# Altium project BTB.PrjPcb (part 1 of 2)
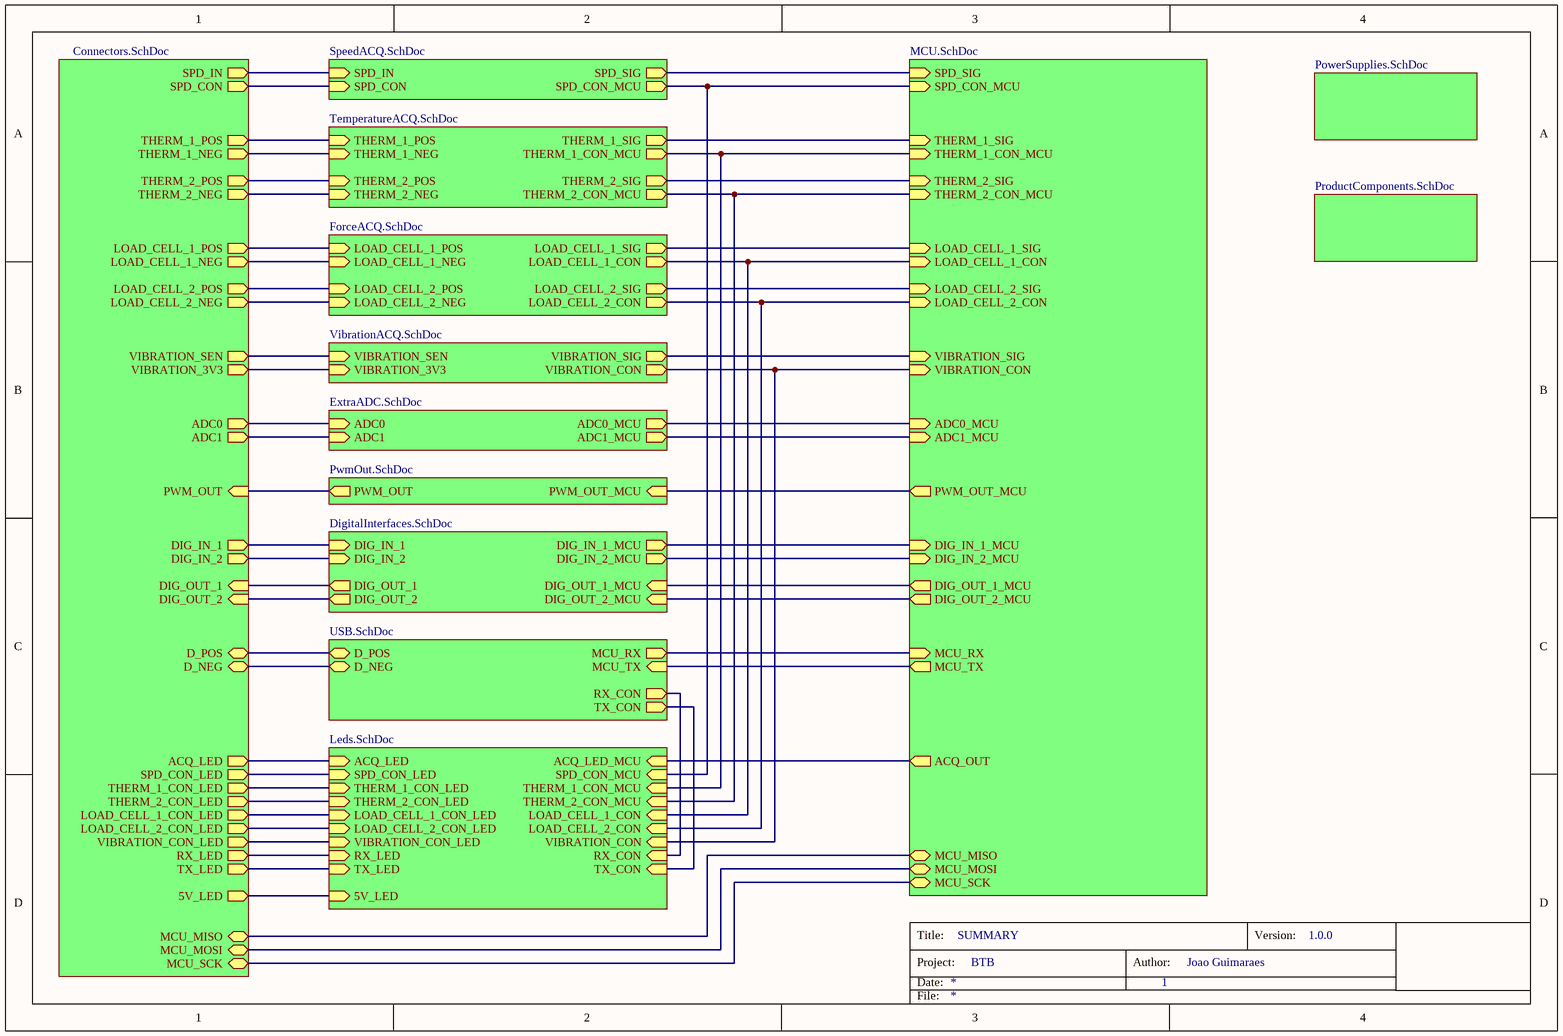
[diagram p0: SUMMARY.SchDoc]
ProjectName: BTB; ProjectVersion: 1.0.0
14 sheets, 231 parts. Net scope: hierarchical (ports join the sheet entries above them; power ports are global).
Board file: PCB.PcbDoc
Sheets:
  SUMMARY.SchDoc
    TemperatureACQ = TemperatureACQ.SchDoc
    ForceACQ = ForceACQ.SchDoc
    VibrationACQ = VibrationACQ.SchDoc
    SpeedACQ = SpeedACQ.SchDoc
    PowerSupplies = PowerSupplies.SchDoc
    MCU = MCU.SchDoc
    PwmOut = PwmOut.SchDoc
    DigitalIntefaces = DigitalInterfaces.SchDoc
    Connectors = Connectors.SchDoc
    Leds = Leds.SchDoc
    USB = USB.SchDoc
    Designator = ExtraADC.SchDoc
    ProductComponents = ProductComponents.SchDoc

## Sheet SUMMARY.SchDoc: SUMMARY
size A4; Author: Joao Guimaraes; Organization: Altium Limited; Address1: L3, 12a Rodborough Rd; Address2: Frenchs Forest; Address3: NSW; Address4: Australia 2086; Revision: 1.0.0; SheetNumber: 1

### Sub-sheets
Connectors = Connectors.SchDoc: SPD_IN (out), SPD_CON (out), THERM_1_POS (out), THERM_1_NEG (out), THERM_2_POS (out), THERM_2_NEG (out), LOAD_CELL_1_POS (out), LOAD_CELL_1_NEG (out), LOAD_CELL_2_POS (out), LOAD_CELL_2_NEG (out), VIBRATION_SEN (out), VIBRATION_3V3 (out), DIG_IN_1 (out), DIG_IN_2 (out), DIG_OUT_1 (in), DIG_OUT_2 (in), D_POS, D_NEG, MCU_MISO, MCU_MOSI, MCU_SCK, ACQ_LED (out), RX_LED (out), SPD_CON_LED (out), THERM_1_CON_LED (out), THERM_2_CON_LED (out), LOAD_CELL_1_CON_LED (out), LOAD_CELL_2_CON_LED (out), VIBRATION_CON_LED (out), TX_LED (out), ADC1 (out), PWM_OUT (in), ADC0 (out), 5V_LED (out)
Designator = ExtraADC.SchDoc: ADC0 (in), ADC1 (in), ADC0_MCU (out), ADC1_MCU (out)
DigitalIntefaces = DigitalInterfaces.SchDoc: DIG_IN_1 (in), DIG_IN_2 (in), DIG_OUT_1 (out), DIG_OUT_2 (out), DIG_IN_1_MCU (out), DIG_IN_2_MCU (out), DIG_OUT_1_MCU (in), DIG_OUT_2_MCU (in)
ForceACQ = ForceACQ.SchDoc: LOAD_CELL_1_POS (in), LOAD_CELL_1_NEG (in), LOAD_CELL_2_POS (in), LOAD_CELL_2_NEG (in), LOAD_CELL_1_CON (out), LOAD_CELL_1_SIG (out), LOAD_CELL_2_SIG (out), LOAD_CELL_2_CON (out)
Leds = Leds.SchDoc: ACQ_LED_MCU (in), SPD_CON_MCU (in), THERM_1_CON_MCU (in), THERM_2_CON_MCU (in), LOAD_CELL_1_CON (in), LOAD_CELL_2_CON (in), VIBRATION_CON (in), ACQ_LED (in), SPD_CON_LED (in), THERM_1_CON_LED (in), THERM_2_CON_LED (in), LOAD_CELL_1_CON_LED (in), LOAD_CELL_2_CON_LED (in), VIBRATION_CON_LED (in), RX_CON (in), TX_CON (in), RX_LED (in), TX_LED (in), 5V_LED (in)
MCU = MCU.SchDoc: SPD_SIG (in), SPD_CON_MCU (in), THERM_1_SIG (in), THERM_1_CON_MCU (in), THERM_2_SIG (in), THERM_2_CON_MCU (in), LOAD_CELL_1_SIG (in), LOAD_CELL_1_CON (in), LOAD_CELL_2_SIG (in), LOAD_CELL_2_CON (in), VIBRATION_SIG (in), VIBRATION_CON (in), PWM_OUT_MCU (out), DIG_IN_1_MCU (in), DIG_IN_2_MCU (in), DIG_OUT_1_MCU (out), DIG_OUT_2_MCU (out), MCU_RX (in), MCU_TX (out), MCU_MISO, MCU_MOSI, MCU_SCK, ACQ_OUT (out), ADC0_MCU (in), ADC1_MCU (in)
PowerSupplies = PowerSupplies.SchDoc: no entries
ProductComponents = ProductComponents.SchDoc: no entries
PwmOut = PwmOut.SchDoc: PWM_OUT_MCU (in), PWM_OUT (out)
SpeedACQ = SpeedACQ.SchDoc: SPD_IN (in), SPD_SIG (out), SPD_CON_MCU (out), SPD_CON (in)
TemperatureACQ = TemperatureACQ.SchDoc: THERM_1_NEG (in), THERM_2_POS (in), THERM_2_NEG (in), THERM_1_POS (in), THERM_1_SIG (out), THERM_1_CON_MCU (out), THERM_2_SIG (out), THERM_2_CON_MCU (out)
USB = USB.SchDoc: D_POS, D_NEG, MCU_RX (out), MCU_TX (in), RX_CON (out), TX_CON (out)
VibrationACQ = VibrationACQ.SchDoc: VIBRATION_SEN (in), VIBRATION_3V3 (in), VIBRATION_SIG (out), VIBRATION_CON (out)

### Nets
NetC6_2: sheet VibrationACQ/VIBRATION_SEN, sheet Connectors/VIBRATION_SEN
NetC36_1: sheet PwmOut/PWM_OUT, sheet Connectors/PWM_OUT
NetC38_2: sheet SpeedACQ/SPD_SIG, sheet MCU/SPD_SIG
NetP1_5: sheet ForceACQ/LOAD_CELL_1_NEG, sheet Connectors/LOAD_CELL_1_NEG
NetP1_6: sheet ForceACQ/LOAD_CELL_1_POS, sheet Connectors/LOAD_CELL_1_POS
NetP1_10: sheet ForceACQ/LOAD_CELL_2_NEG, sheet Connectors/LOAD_CELL_2_NEG
NetP1_11: sheet ForceACQ/LOAD_CELL_2_POS, sheet Connectors/LOAD_CELL_2_POS
NetP2_1: sheet Connectors/5V_LED, sheet Leds/5V_LED
NetP2_2: sheet Connectors/TX_LED, sheet Leds/TX_LED
NetP2_3: sheet Connectors/RX_LED, sheet Leds/RX_LED
NetP2_4: sheet Connectors/ACQ_LED, sheet Leds/ACQ_LED
NetP2_5: sheet Connectors/SPD_CON_LED, sheet Leds/SPD_CON_LED
NetP2_6: sheet Connectors/THERM_1_CON_LED, sheet Leds/THERM_1_CON_LED
NetP2_7: sheet Connectors/THERM_2_CON_LED, sheet Leds/THERM_2_CON_LED
NetP2_8: sheet Connectors/LOAD_CELL_1_CON_LED, sheet Leds/LOAD_CELL_1_CON_LED
NetP2_9: sheet Connectors/LOAD_CELL_2_CON_LED, sheet Leds/LOAD_CELL_2_CON_LED
NetP2_10: sheet Connectors/VIBRATION_CON_LED, sheet Leds/VIBRATION_CON_LED
NetP2_12: sheet Connectors/ADC0, sheet Designator/ADC0
NetP2_14: sheet Connectors/ADC1, sheet Designator/ADC1
NetP3_2: sheet Connectors/D_POS, sheet USB/D_POS
NetP3_3: sheet Connectors/D_NEG, sheet USB/D_NEG
NetP3_7: sheet VibrationACQ/VIBRATION_3V3, sheet Connectors/VIBRATION_3V3
NetP3_12: sheet SpeedACQ/SPD_IN, sheet Connectors/SPD_IN
NetP3_13: sheet SpeedACQ/SPD_CON, sheet Connectors/SPD_CON
NetP4_1: sheet TemperatureACQ/THERM_1_POS, sheet Connectors/THERM_1_POS
NetP4_2: sheet TemperatureACQ/THERM_1_NEG, sheet Connectors/THERM_1_NEG
NetP4_3: sheet TemperatureACQ/THERM_2_POS, sheet Connectors/THERM_2_POS
NetP4_4: sheet TemperatureACQ/THERM_2_NEG, sheet Connectors/THERM_2_NEG
NetP4_5: sheet DigitalIntefaces/DIG_OUT_1, sheet Connectors/DIG_OUT_1
NetP4_7: sheet DigitalIntefaces/DIG_OUT_2, sheet Connectors/DIG_OUT_2
NetP4_9: sheet DigitalIntefaces/DIG_IN_1, sheet Connectors/DIG_IN_1
NetP4_11: sheet DigitalIntefaces/DIG_IN_2, sheet Connectors/DIG_IN_2
NetP5_1: sheet MCU/DIG_IN_2_MCU, sheet MCU/MCU_MISO, sheet DigitalIntefaces/DIG_IN_2_MCU, sheet Connectors/MCU_MISO
NetP5_3: sheet MCU/MCU_SCK, sheet MCU/ACQ_OUT, sheet Connectors/MCU_SCK, sheet Leds/ACQ_LED_MCU
NetP5_4: sheet MCU/DIG_IN_1_MCU, sheet MCU/MCU_MOSI, sheet DigitalIntefaces/DIG_IN_1_MCU, sheet Connectors/MCU_MOSI
NetQ5_2: sheet Leds/TX_CON, sheet USB/TX_CON
NetQ5_5: sheet Leds/RX_CON, sheet USB/RX_CON
NetQ6_3: sheet SpeedACQ/SPD_CON_MCU, sheet MCU/SPD_CON_MCU, sheet Leds/SPD_CON_MCU
NetQ7_3: sheet VibrationACQ/VIBRATION_CON, sheet MCU/VIBRATION_CON, sheet Leds/VIBRATION_CON
NetR7_1: sheet MCU/DIG_OUT_1_MCU, sheet DigitalIntefaces/DIG_OUT_1_MCU
NetR13_1: sheet MCU/DIG_OUT_2_MCU, sheet DigitalIntefaces/DIG_OUT_2_MCU
NetR15_2: sheet MCU/ADC0_MCU, sheet Designator/ADC0_MCU
NetR17_1: sheet MCU/ADC1_MCU, sheet Designator/ADC1_MCU
NetR19_2: sheet ForceACQ/LOAD_CELL_1_CON, sheet MCU/LOAD_CELL_1_CON, sheet Leds/LOAD_CELL_1_CON
NetR20_2: sheet ForceACQ/LOAD_CELL_1_SIG, sheet MCU/LOAD_CELL_1_SIG
NetR27_2: sheet ForceACQ/LOAD_CELL_2_CON, sheet MCU/LOAD_CELL_2_CON, sheet Leds/LOAD_CELL_2_CON
NetR28_2: sheet ForceACQ/LOAD_CELL_2_SIG, sheet MCU/LOAD_CELL_2_SIG
NetR45_2: sheet TemperatureACQ/THERM_2_CON_MCU, sheet MCU/THERM_2_CON_MCU, sheet Leds/THERM_2_CON_MCU
NetR46_2: sheet TemperatureACQ/THERM_1_CON_MCU, sheet MCU/THERM_1_CON_MCU, sheet Leds/THERM_1_CON_MCU
NetR64_1: sheet MCU/PWM_OUT_MCU, sheet PwmOut/PWM_OUT_MCU
NetR79_1: sheet TemperatureACQ/THERM_1_SIG, sheet MCU/THERM_1_SIG
NetR88_1: sheet TemperatureACQ/THERM_2_SIG, sheet MCU/THERM_2_SIG
NetR96_2: sheet MCU/MCU_TX, sheet USB/MCU_TX
NetR97_2: sheet MCU/MCU_RX, sheet USB/MCU_RX
NetR99_1: sheet VibrationACQ/VIBRATION_SIG, sheet MCU/VIBRATION_SIG

### Notes on the sheet
- Title:
- Project:
- Date:
- Author:
- Version:
- File:

## Sheet TemperatureACQ.SchDoc: TemperatureACQ
size A4; Author: Joao Guimaraes; Organization: Altium Limited; Address1: L3, 12a Rodborough Rd; Address2: Frenchs Forest; Address3: NSW; Address4: Australia 2086; Revision: 1.0
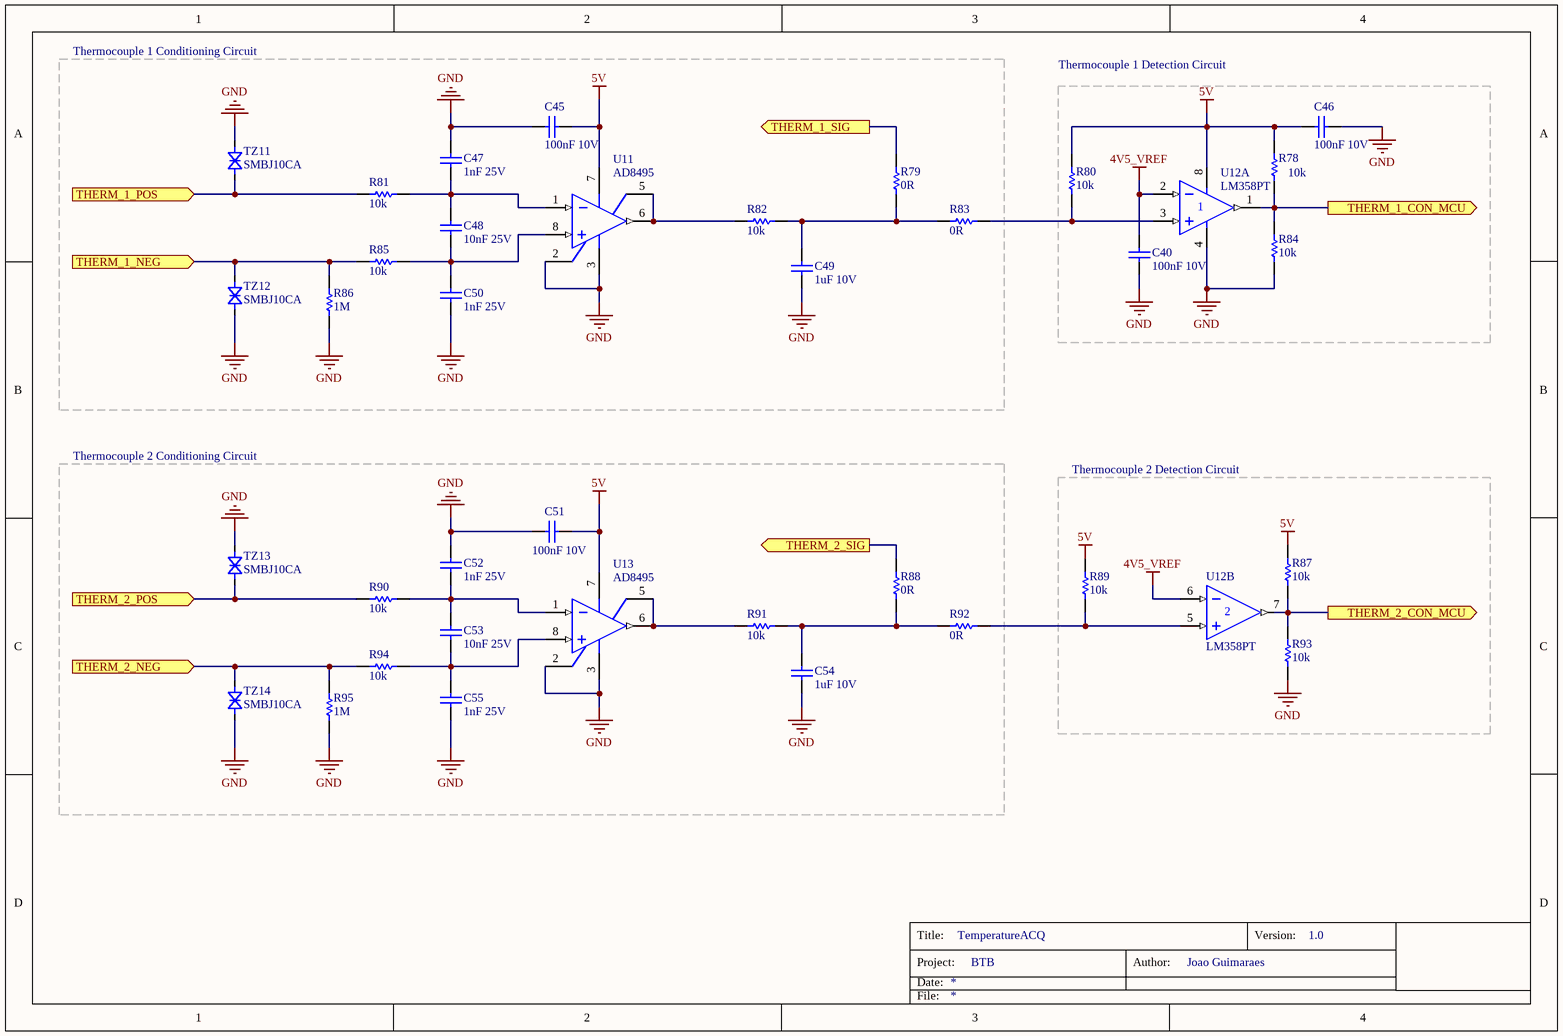
[diagram p1: TemperatureACQ.SchDoc]

### Parts
C40  100nF 10V  [0402]
C45  100nF 10V  [0402]
C46  100nF 10V  [0402]
C47  1nF 25V  [1608[0603]]
C48  10nF 25V  [1608[0603]]
C49  1uF 10V  [C0805]
C50  1nF 25V  [1608[0603]]
C51  100nF 10V  [0402]
C52  1nF 25V  [1608[0603]]
C53  10nF 25V  [1608[0603]]
C54  1uF 10V  [C0805]
C55  1nF 25V  [1608[0603]]
R78  10k  [6-0805_M]
R79  0R  [6-0805_M]
R80  10k  [6-0805_M]
R81  10k  [6-0805_M]
R82  10k  [6-0805_M]
R83  0R  [6-0805_M]
R84  10k  [6-0805_M]
R85  10k  [6-0805_M]
R86  1M  [6-0805_M]
R87  10k  [6-0805_M]
R88  0R  [6-0805_M]
R89  10k  [6-0805_M]
R90  10k  [6-0805_M]
R91  10k  [6-0805_M]
R92  0R  [6-0805_M]
R93  10k  [6-0805_M]
R94  10k  [6-0805_M]
R95  1M  [6-0805_M]
TZ11  SMBJ10CA  [DO-214AA]
TZ12  SMBJ10CA  [DO-214AA]
TZ13  SMBJ10CA  [DO-214AA]
TZ14  SMBJ10CA  [DO-214AA]
U11  AD8495  [RM_8]
U12  LM358PT  [TSOP-8]  (parts A,B of 2)
U13  AD8495  [RM_8]

### Blocks framed on the sheet
Thermocouple 1 Conditioning Circuit: C45 C47-C50 R79 R81-R83 R85 R86 TZ11 TZ12 U11
Thermocouple 1 Detection Circuit: C40 C46 R78 R80 R84 U12
Thermocouple 2 Conditioning Circuit: C51-C55 R88 R90-R92 R94 R95 TZ13 TZ14 U13
Thermocouple 2 Detection Circuit: R87 R89 R93 U12

### Ports
THERM_1_CON_MCU (out), THERM_1_NEG (in), THERM_1_POS (in), THERM_1_SIG (out), THERM_2_CON_MCU (out), THERM_2_NEG (in), THERM_2_POS (in), THERM_2_SIG (out)

### Nets
4V5_VREF: C40.2 U12.2(IN-) U12.6(IN-)
5V: C45.2 C46.2 C51.2 R78.1 R80.1 R87.1 R89.1 U11.7(V+) U12.8(Vs+) U13.7(V+)
GND: C40.1 C45.1 C46.1 C47.2 C49.1 C50.1 C51.1 C52.2 C54.1 C55.1 R84.2 R86.1 R93.2 R95.1 TZ11.2(A) TZ12.1(C) TZ13.2(A) TZ14.1(C) U11.2(REF) U11.3(V-) U12.4(Vs-) U13.2(REF) U13.3(V-)
NetC47_1: C47.1 C48.2 R81.2 U11.1(IN-)
NetC48_1: C48.1 C50.2 R85.2 U11.8(IN+)
NetC49_2: C49.2 R79.2 R82.1 R83.1
NetC52_1: C52.1 C53.2 R90.2 U13.1(IN-)
NetC53_1: C53.1 C55.2 R94.2 U13.8(IN+)
NetC54_2: C54.2 R88.2 R91.1 R92.1
NetP4_1: R81.1 TZ11.1(C) ; port THERM_1_POS
NetP4_2: R85.1 R86.2 TZ12.2(A) ; port THERM_1_NEG
NetP4_3: R90.1 TZ13.1(C) ; port THERM_2_POS
NetP4_4: R94.1 R95.2 TZ14.2(A) ; port THERM_2_NEG
NetR45_2: R87.2 R93.1 U12.7(OUT) ; port THERM_2_CON_MCU
NetR46_2: R78.2 R84.1 U12.1(OUT) ; port THERM_1_CON_MCU
NetR79_1: R79.1 ; port THERM_1_SIG
NetR80_2: R80.2 R83.2 U12.3(IN+)
NetR82_2: R82.2 U11.5(SENSE) U11.6(OUT)
NetR88_1: R88.1 ; port THERM_2_SIG
NetR89_2: R89.2 R92.2 U12.5(IN+)
NetR91_2: R91.2 U13.5(SENSE) U13.6(OUT)

### Notes on the sheet
- Title:
- Project:
- Date:
- Author:
- Version:
- File:

### Library data of the parts
C40 C45 C46 C51 = Cap: Capacitor; PartNumber: CAP.100n.10V.20%.SMD.0402; Manufacturer: Wurth; ClassName: TemperatureACQ; Price: 0.015; Supplier: Mouser
C47 C55 = Cap: Capacitor; PartNumber: CAP.1n.25V.10%.SMD.0603; Manufacturer: Wurth; ClassName: TemperatureACQ; Price: 0.10; Supplier: Mouser
C48 C53 = Cap: Capacitor; PartNumber: CAP.10n.25V.10%.SMD.0603; Manufacturer: Wurth; ClassName: TemperatureACQ; Price: 0.10; Supplier: Mouser
C49 C54 = Cap: Capacitor; PartNumber: CAP.1u.10V.10%.SMD.0805; Manufacturer: Vishay; ClassName: TemperatureACQ; Price: 0.17; Supplier: Mouser
C50 C52 = Cap: Capacitor; PartNumber: CAP.1n.25V.10%.SMD.0603; Manufacturer: Vishay; ClassName: TemperatureACQ; Price: 0.10; Supplier: Mouser
R78 R81 R82 R84 R85 R87 R90 R91 R93 R94 = Res: Resistor; PartNumber: RES.10K.1/8W.5%.SMD.0805; Manufacturer: Yageo; ClassName: TemperatureACQ; Price: 0.012; Supplier: Mouser
R79 R83 R88 R92 = Res: Resistor; PartNumber: RES.0R.1/8W.5%.SMD.0805; Manufacturer: Vishay; ClassName: TemperatureACQ; Price: 0.044; Supplier: Mouser
R80 R89 = Res: Resistor; PartNumber: RES.10k.1/8W.5%.SMD.0805; Manufacturer: Bourns; ClassName: TemperatureACQ; Price: 0.012; Supplier: Mouser
R86 R95 = Res: Resistor; PartNumber: RES.1M.1/8W.5%.SMD.0805; Manufacturer: Bourns; ClassName: TemperatureACQ; Price: 0.012; Supplier: Mouser
TZ11-TZ14 = SMBJ10CA: ESD Suppressors / TVS Diodes 600W 10.0V; pin to pad: 1>C 2>A; PartNumber: SMBJ10CA-13-F; ClassName: TemperatureACQ; Price: 0.35; Supplier: Mouser; Manufacturer: Diodes
U11 U13 = AD8495: Precision Type K Thermocouple Amplifier with Cold Junction Compensation; PartNumber: AD8495CRMZ-R7; Manufacturer: Analog Devices; ClassName: TemperatureACQ; Price: 10.84; Supplier: Mouser
U12 = LM358PT: Operational Amplifiers - Op Amps Dual Low Power; Manufacturer: STMicroelectronics; ClassName: TemperatureACQ; PartNumber: LM358PT; Price: 0.40; Supplier: Mouser

## Sheet ForceACQ.SchDoc: Force Acquisition Channel
size A4; Author: Joao Guimarae; Organization: Altium Limited; Address1: L3, 12a Rodborough Rd; Address2: Frenchs Forest; Address3: NSW; Address4: Australia 2086; Revision: 1.0.0
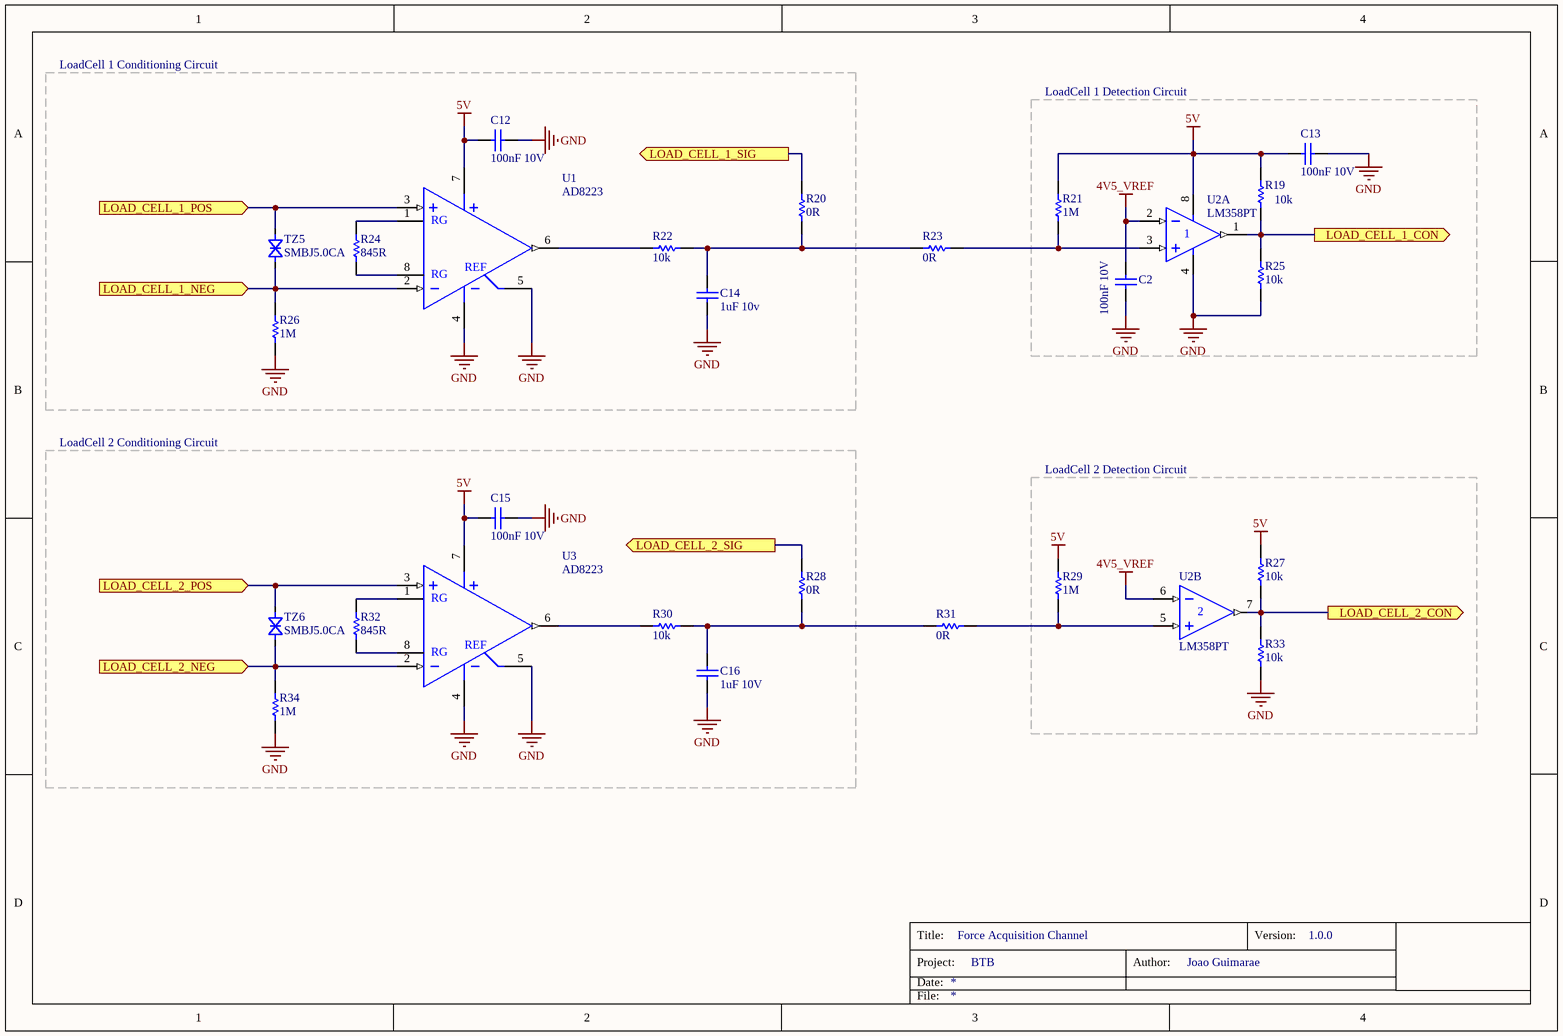
[diagram p2: ForceACQ.SchDoc]

### Parts
C2  100nF 10V  [0402]
C12  100nF 10V  [0402]
C13  100nF 10V  [0402]
C14  1uF 10v  [C0805]
C15  100nF 10V  [0402]
C16  1uF 10V  [C0805]
R19  10k  [6-0805_M]
R20  0R  [6-0805_M]
R21  1M  [6-0805_M]
R22  10k  [6-0805_M]
R23  0R  [6-0805_M]
R24  845R  [0402]
R25  10k  [6-0805_M]
R26  1M  [6-0805_M]
R27  10k  [6-0805_M]
R28  0R  [6-0805_M]
R29  1M  [6-0805_M]
R30  10k  [6-0805_M]
R31  0R  [6-0805_M]
R32  845R  [0402]
R33  10k  [6-0805_M]
R34  1M  [6-0805_M]
TZ5  SMBJ5.0CA  [DO-214AA]
TZ6  SMBJ5.0CA  [DO-214AA]
U1  AD8223  [SO8_M]
U2  LM358PT  [TSOP-8]  (parts A,B of 2)
U3  AD8223  [SO8_M]

### Blocks framed on the sheet
LoadCell 1 Conditioning Circuit: C12 C14 R20 R22 R24 R26 TZ5 U1
LoadCell 1 Detection Circuit: C2 C13 R19 R21 R25 U2
LoadCell 2 Conditioning Circuit: C15 C16 R28 R30 R32 R34 TZ6 U3
LoadCell 2 Detection Circuit: R27 R29 R33 U2

### Ports
LOAD_CELL_1_CON (out), LOAD_CELL_1_NEG (in), LOAD_CELL_1_POS (in), LOAD_CELL_1_SIG (out), LOAD_CELL_2_CON (out), LOAD_CELL_2_NEG (in), LOAD_CELL_2_POS (in), LOAD_CELL_2_SIG (out)

### Nets
4V5_VREF: C2.2 U2.2(IN-) U2.6(IN-)
5V: C12.1 C13.2 C15.1 R19.1 R21.1 R27.1 R29.1 U1.7(+Vs) U2.8(Vs+) U3.7(+Vs)
GND: C2.1 C12.2 C13.1 C14.1 C15.2 C16.1 R25.2 R26.2 R33.2 R34.2 U1.4(-Vs) U1.5(REF) U2.4(Vs-) U3.4(-Vs) U3.5(REF)
NetC14_2: C14.2 R20.1 R22.2 R23.2
NetC16_2: C16.2 R28.1 R30.2 R31.2
NetP1_5: R26.1 TZ5.1(C) U1.2(IN-) ; port LOAD_CELL_1_NEG
NetP1_6: TZ5.2(A) U1.3(IN+) ; port LOAD_CELL_1_POS
NetP1_10: R34.1 TZ6.1(C) U3.2(IN-) ; port LOAD_CELL_2_NEG
NetP1_11: TZ6.2(A) U3.3(IN+) ; port LOAD_CELL_2_POS
NetR19_2: R19.2 R25.1 U2.1(OUT) ; port LOAD_CELL_1_CON
NetR20_2: R20.2 ; port LOAD_CELL_1_SIG
NetR21_2: R21.2 R23.1 U2.3(IN+)
NetR22_1: R22.1 U1.6(OUT)
NetR24_1: R24.1 U1.8(RG)
NetR24_2: R24.2 U1.1(RG)
NetR27_2: R27.2 R33.1 U2.7(OUT) ; port LOAD_CELL_2_CON
NetR28_2: R28.2 ; port LOAD_CELL_2_SIG
NetR29_2: R29.2 R31.1 U2.5(IN+)
NetR30_1: R30.1 U3.6(OUT)
NetR32_1: R32.1 U3.8(RG)
NetR32_2: R32.2 U3.1(RG)

### Notes on the sheet
- Title:
- Project:
- Date:
- Author:
- Version:
- File:

### Library data of the parts
C2 C12 C13 C15 = Cap: as C40 on sheet TemperatureACQ; Price: 0.015; Supplier: Mouser
  C2: ClassName: TemperatureACQ
  C12 C13 C15: ClassName: ForceACQ
C14 C16 = Cap: as C49 on sheet TemperatureACQ; ClassName: ForceACQ; Price: 0.17; Supplier: Mouser
R19 R22 R25 R27 R30 R33 = Res: as R78 on sheet TemperatureACQ; ClassName: ForceACQ; Price: 0.012; Supplier: Mouser
R20 R23 R28 R31 = Res: as R79 on sheet TemperatureACQ; ClassName: ForceACQ; Price: 0.044; Supplier: Mouser
R21 R26 R29 R34 = Res: as R86 on sheet TemperatureACQ; ClassName: ForceACQ; Supplier: Mouser
  R21 R29 R34: Price: 0.012
  R26: Price: 0.10
R24 R32 = Res: Resistor; PartNumber: RES.845R.1/8W.1%.SMD.0402; Manufacturer: Yageo; ClassName: ForceACQ; Price: 0.10; Supplier: Mouser
TZ5 TZ6 = SMBJ5.0CA: ESD Suppressors / TVS Diodes 5Vr 600W 65.3A 5% BiDirectional; pin to pad: 1>C 2>A; Manufacturer: Bourns; ClassName: ForceACQ; PartNumber: SMBJ5.0CA; Price: 0.44; Supplier: Mouser
U1 U3 = AD8223: Precision Instrumentation Amplifier; PartNumber: AD8223ARZ; Manufacturer: Analog Devices; ClassName: ForceACQ; Price: 2.89; Supplier: Mouser
U2 = LM358PT: as U12 on sheet TemperatureACQ; ClassName: ForceACQ; PartNumber: LM358PT; Price: 0.40; Supplier: Mouser

## Sheet VibrationACQ.SchDoc: VibrationACQ
size A4; Author: Joao Guimaraes; Organization: Altium Limited; Address1: L3, 12a Rodborough Rd; Address2: Frenchs Forest; Address3: NSW; Address4: Australia 2086; Revision: 1.0.0
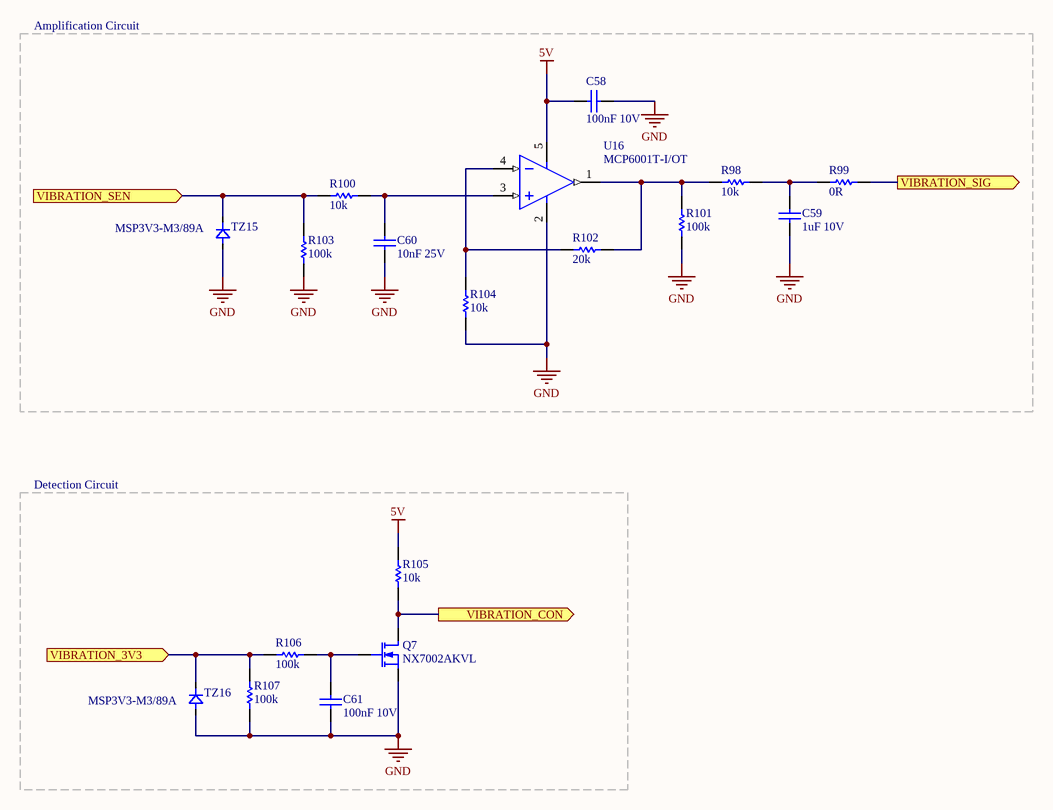
[diagram p3: VibrationACQ.SchDoc]

### Parts
C58  100nF 10V  [0402]
C59  1uF 10V  [C0805]
C60  10nF 25V  [1608[0603]]
C61  100nF 10V  [0402]
Q7  NX7002AKVL  [SOT23_M]
R98  10k  [6-0805_M]
R99  0R  [6-0805_M]
R100  10k  [6-0805_M]
R101  100k  [6-0805_M]
R102  20k  [6-0805_M]
R103  100k  [6-0805_M]
R104  10k  [6-0805_M]
R105  10k  [6-0805_M]
R106  100k  [6-0805_M]
R107  100k  [6-0805_M]
TZ15  MSP3V3-M3/89A  [DO-219AD]
TZ16  MSP3V3-M3/89A  [DO-219AD]
U16  MCP6001T-I/OT  [SOT23-5]

### Blocks framed on the sheet
Amplification Circuit: C58-C60 R98-R104 TZ15 U16
Detection Circuit: C61 Q7 R105-R107 TZ16

### Ports
VIBRATION_3V3 (in), VIBRATION_CON (out), VIBRATION_SEN (in), VIBRATION_SIG (out)

### Nets
5V: C58.1 R105.2 U16.5(V+)
GND: C58.2 C59.1 C60.1 C61.1 Q7.2(S) R101.1 R103.2 R104.1 R107.2 TZ15.1(A) TZ16.1(A) U16.2(V-)
NetC6_2: R100.1 R103.1 TZ15.2(C) ; port VIBRATION_SEN
NetC59_2: C59.2 R98.1 R99.2
NetC60_2: C60.2 R100.2 U16.3(IN+)
NetC61_2: C61.2 Q7.1(G) R106.1
NetP3_7: R106.2 R107.1 TZ16.2(C) ; port VIBRATION_3V3
NetQ7_3: Q7.3(D) R105.1 ; port VIBRATION_CON
NetR98_2: R98.2 R101.2 R102.2 U16.1(Out)
NetR99_1: R99.1 ; port VIBRATION_SIG
NetR102_1: R102.1 R104.2 U16.4(IN-)

### Notes on the sheet
- Title:
- Project:
- Date:
- Author:
- Version:
- File:

### Library data of the parts
C58 C61 = Cap: as C40 on sheet TemperatureACQ; ClassName: VibrationACQ; Price: 0.015; Supplier: Mouser
C59 = Cap: as C49 on sheet TemperatureACQ; ClassName: VibrationACQ; Price: 0.17; Supplier: Mouser
C60 = Cap: as C48 on sheet TemperatureACQ; ClassName: VibrationACQ; Price: 0.10; Supplier: Mouser
Q7 = NX7002AKVL: Small Signal MOSFET 60 V, 310 mA, Single, N−Channel, SOT−23; Manufacturer: Nexperia; ClassName: VibrationACQ; PartNumber: NX7002AKVL; Price: 0.16; Supplier: Mouser
R98 R100 R104 R105 = Res: as R78 on sheet TemperatureACQ; ClassName: VibrationACQ; Price: 0.012; Supplier: Mouser
R99 = Res: as R79 on sheet TemperatureACQ; ClassName: VibrationACQ; Price: 0.044; Supplier: Mouser
R101 R106 = Res: Resistor; PartNumber: RES.100K.1/8W.5%.SMD.0805; Manufacturer: Yageo; ClassName: VibrationACQ; Price: 0.012; Supplier: Mouser
R102 = Res: Resistor; PartNumber: RES.20K.1/8W.1%.SMD.0805; Manufacturer: Vishay; ClassName: VibrationACQ; Price: 0.10; Supplier: Mouser
R103 R107 = Res: Resistor; PartNumber: RES.100k.1/8W.5%.SMD.0805; Manufacturer: Bourns; ClassName: VibrationACQ; Price: 0.012; Supplier: Mouser
TZ15 TZ16 = MSP3V3-M3/89A: ESD Suppressors / TVS Diodes 100W 3.3V Unidirect; pin to pad: 1>A 2>C; Manufacturer: Vishay; ClassName: VibrationACQ; PartNumber: MSP3V3-M3/89A; Price: 0.41; Supplier: Mouser
U16 = MCP6001T-I/OT: Operational Amplifiers - Op Amps Single 1.8V 1MHz; Manufacturer: Microchip; ClassName: VibrationACQ; PartNumber: MCP6001T-I/OT; Price: 0.29; Supplier: Mouser

## Sheet SpeedACQ.SchDoc: SpeedACQ
size A4; Author: Joao Guimaraes; Organization: Altium Limited; Address1: L3, 12a Rodborough Rd; Address2: Frenchs Forest; Address3: NSW; Address4: Australia 2086; Revision: 1.0.0
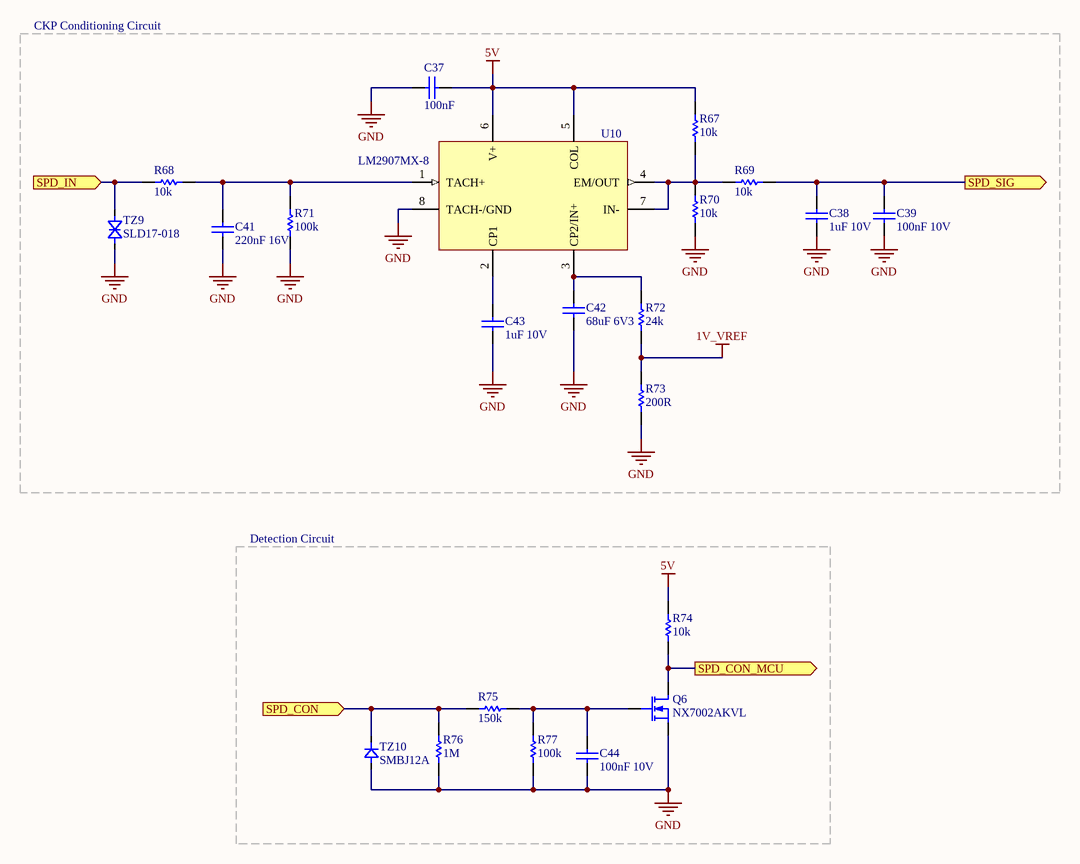
[diagram p4: SpeedACQ.SchDoc]

### Parts
C37  100nF  [0402]
C38  1uF 10V  [C0805]
C39  100nF 10V  [0402]
C41  220nF 16V  [0402]
C42  68uF 6V3  [C0805]
C43  1uF 10V  [C0805]
C44  100nF 10V  [0402]
Q6  NX7002AKVL  [SOT23_M]
R67  10k  [6-0805_M]
R68  10k  [6-0805_M]
R69  10k  [6-0805_M]
R70  10k  [6-0805_M]
R71  100k  [6-0805_M]
R72  24k  [6-0805_M]
R73  200R  [6-0805_M]
R74  10k  [6-0805_M]
R75  150k  [6-0805_M]
R76  1M  [6-0805_M]
R77  100k  [6-0805_M]
TZ9  SLD17-018  [PIN-W2/E2.8]
TZ10  SMBJ12A  [DO-214AA]
U10  LM2907MX-8  [SO8_M]

### Blocks framed on the sheet
CKP Conditioning Circuit: C37-C39 C41-C43 R67-R73 TZ9 U10
Detection Circuit: C44 Q6 R74-R77 TZ10

### Ports
SPD_CON (in), SPD_CON_MCU (out), SPD_IN (in), SPD_SIG (out)

### Nets
1V_VREF: R72.1 R73.2
5V: C37.2 R67.2 R74.2 U10.5(COL) U10.6(V+)
GND: C37.1 C38.1 C39.1 C41.1 C42.1 C43.1 C44.1 Q6.2(S) R70.1 R71.1 R73.1 R76.2 R77.1 TZ9.1(A) TZ10.1(A) U10.8(TACH-/GND)
NetC38_2: C38.2 C39.2 R69.2 ; port SPD_SIG
NetC41_2: C41.2 R68.2 R71.2 U10.1(TACH+)
NetC42_2: C42.2 R72.2 U10.3(CP2/IN+)
NetC43_2: C43.2 U10.2(CP1)
NetC44_2: C44.2 Q6.1(G) R75.2 R77.2
NetP3_12: R68.1 TZ9.2(K) ; port SPD_IN
NetP3_13: R75.1 R76.1 TZ10.2(C) ; port SPD_CON
NetQ6_3: Q6.3(D) R74.1 ; port SPD_CON_MCU
NetR67_1: R67.1 R69.1 R70.2 U10.4(EM/OUT) U10.7(IN-)

### Notes on the sheet
- Title:
- Project:
- Date:
- Author:
- Version:
- File:

### Library data of the parts
C37 C39 C44 = Cap: as C40 on sheet TemperatureACQ; ClassName: SpeedACQ; Price: 0.015; Supplier: Mouser
C38 = Cap: Capacitor; PartNumber: CAP.1u.10V.5%.SMD.0805; Manufacturer: Vishay; ClassName: SpeedACQ; Price: 0.17; Supplier: Mouser
C41 = Cap: Capacitor; PartNumber: CAP.0.22u.16V.5%.SMD.0805; Manufacturer: Wurth; ClassName: SpeedACQ; Price: .10; Supplier: Mouser
C42 = Cap: Capacitor; PartNumber: CAP.68u.6V3.5%.SMD.0805; Manufacturer: Vishay; ClassName: SpeedACQ; Price: 0.88; Supplier: Mouser
C43 = Cap: as C49 on sheet TemperatureACQ; ClassName: SpeedACQ; Price: 0.17; Supplier: Mouser
Q6 = NX7002AKVL: as Q7 on sheet VibrationACQ; ClassName: SpeedACQ; Price: 0.16; PartNumber: NX7002AKVL; Supplier: Mouser
R67-R70 R74 = Res: as R78 on sheet TemperatureACQ; ClassName: SpeedACQ; Price: 0.012; Supplier: Mouser
R71 R77 = Res: as R101 on sheet VibrationACQ; ClassName: SpeedACQ; Price: 0.012; Supplier: Mouser
R72 = Res: Resistor; PartNumber: RES.24K.1/8W.5%.SMD.0805; Manufacturer: Vishay; ClassName: SpeedACQ; Price: 0.10; Supplier: Mouser
R73 = Res: Resistor; PartNumber: RES.200R.1/8W.1%.SMD.0805; Manufacturer: Vishay; ClassName: SpeedACQ; Price: 0.10; Supplier: Mouser
R75 = Res: Resistor; PartNumber: RES.150K.1/8W.5%.SMD.0805; Manufacturer: Vishay; ClassName: SpeedACQ; Price: 0.10; Supplier: Mouser
R76 = Res: as R86 on sheet TemperatureACQ; ClassName: SpeedACQ; Price: 0.012; Supplier: Mouser
TZ9 = SLD30-018: TVS Bi-Directional VR=30V; Manufacturer: Littelfuse; ClassName: PowerSupplies; PartNumber: SLD17-018; Price: 3.17; Supplier: Mouser
TZ10 = SMBJ12A: ESD Suppressors / TVS Diodes 12V 600W SMB Unidirectional; pin to pad: 1>A 2>C; Manufacturer: ON Semiconductor; ClassName: SpeedACQ; Price: 0.37; PartNumber: SMBJ12A; Supplier: Mouser
U10 = LM2907MX-8: Voltage to Frequency & Frequency to Voltage Frequency to Voltage Converter; Manufacturer: Texas Instruments; ClassName: SpeedACQ; Price: 2.03; PartNumber: LM2907MX-8; Supplier: Mouser

## Sheet PowerSupplies.SchDoc: PowerSupplies
size A4; Author: Joao Guimaraes; Organization: Altium Limited; Address1: L3, 12a Rodborough Rd; Address2: Frenchs Forest; Address3: NSW; Address4: Australia 2086; Revision: 1.0.0
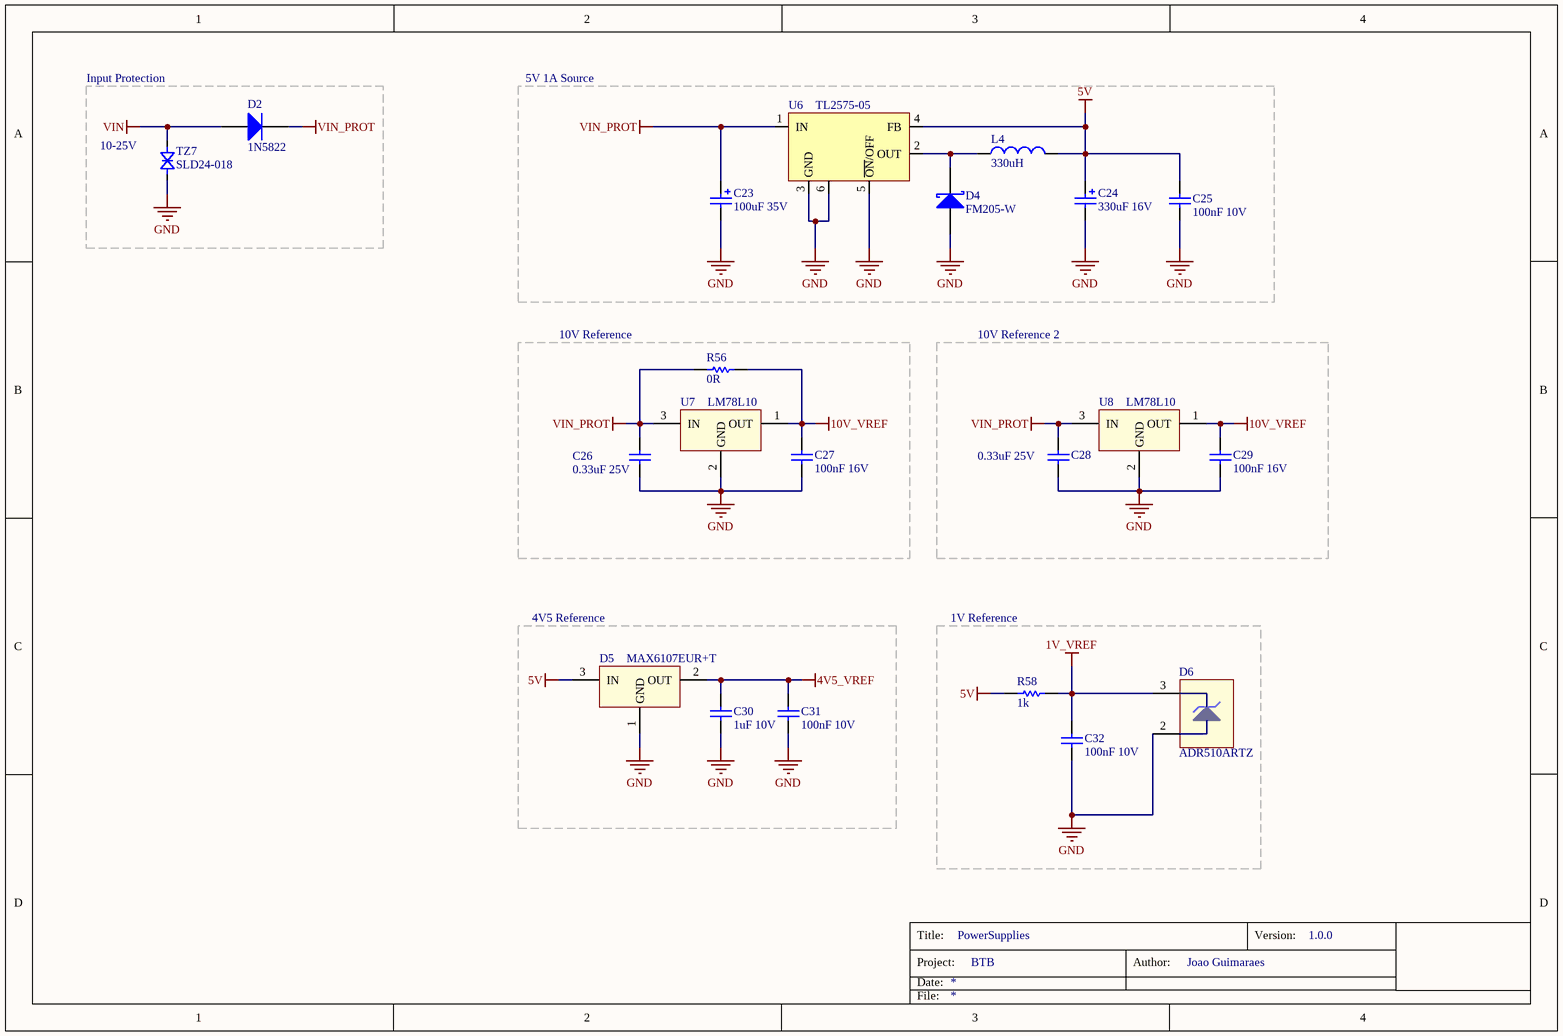
[diagram p5: PowerSupplies.SchDoc]

### Parts
C23  100uF 35V  [WCAP-ASLI_6.3x7.7]
C24  330uF 16V  [WCAP-ASLI_6.3x5.5]
C25  100nF 10V  [C0805]
C26  0.33uF 25V  [C0805]
C27  100nF 16V  [C0805]
C28  0.33uF 25V  [C0805]
C29  100nF 16V  [C0805]
C30  1uF 10V  [C0805]
C31  100nF 10V  [C0805]
C32  100nF 10V  [C0805]
D2  1N5822  [PIN-W2/E2.8]
D4  FM205-W  [DO-214AC]
D5  MAX6107EUR+T  [SOT23_M]
D6  ADR510ARTZ  [SOT23_M]
L4  330uH  [SDE0805A]
R56  0R  [6-0805_M]
R58  1k  [6-0805_M]
TZ7  SLD24-018  [P600]
U6  TL2575-05  [TO-263-5]
U7  LM78L10  [TO-92A]
U8  LM78L10  [TO-92A]

### Blocks framed on the sheet
5V 1A Source: C23-C25 D4 L4 U6
10V Reference: C26 C27 R56 U7
10V Reference 2: C28 C29 U8
4V5 Reference: C30 C31 D5
1V Reference: C32 D6 R58

### Nets
1V_VREF: C32.1 D6.3(K) R58.2
4V5_VREF: C30.1 C31.1 D5.2(OUT)
5V: C24.1 C25.1 D5.3(IN) L4.2 R58.1 U6.4(FB)
10V_VREF: C27.1 C29.1 R56.2 U7.1(OUT) U8.1(OUT)
GND: C23.2 C24.2 C25.2 C26.2 C27.2 C28.2 C29.2 C30.2 C31.2 C32.2 D4.1(A) D5.1(GND) D6.2(A) TZ7.1(A) U6.3(GND) U6.5(~{ON}/OFF) U6.6(GND) U7.2(GND) U8.2(GND)
VIN: D2.1(A) TZ7.2(K)
VIN_PROT: C23.1 C26.1 C28.1 D2.2(K) R56.1 U6.1(IN) U7.3(IN) U8.3(IN)
NetD4_2: D4.2(K) L4.1 U6.2(OUT)

### Notes on the sheet
- Input Protection
- (near TZ7) 10-25V
- Title:
- Project:
- Date:
- Author:
- Version:
- File:

### Library data of the parts
C23 = Cap Pol: Polarized Capacitor (Surface Mount); PartNumber: CAP.100u.35V.20%.SMD.6,3x7,7; Manufacturer: Wurth; ClassName: PowerSupplies; Price: 0.36; Supplier: Mouser
C24 = Cap Pol: Polarized Capacitor (Surface Mount); PartNumber: CAP.330u.6V3.20%.SMD.6,3x5,4; Manufacturer: Wurth; ClassName: PowerSupplies; Price: 0.24; Supplier: Mouser
C25 = Cap: as C40 on sheet TemperatureACQ; ClassName: PowerSupplies; Price: 0.015; Supplier: Mouser
C26 C28 = Cap: Capacitor; PartNumber: CAP.0.33u.25V.10%.SMD.0805; Manufacturer: Vishay; ClassName: PowerSupplies; Price: 0.11; Supplier: Mouser
C27 = Cap: Capacitor; PartNumber: CAP.100n.16V.10%.SMD.0402; Manufacturer: Wurth; ClassName: PowerSupplies; Price: 0.015; Supplier: Mouser
C29 = Cap: Capacitor; PartNumber: CAP.100n.16V.10%.SMD.0805; Manufacturer: Wurth; ClassName: PowerSupplies; Price: 0.015; Supplier: Mouser
C30-C32 = Cap: as C49 on sheet TemperatureACQ; ClassName: PowerSupplies; Price: 0.17; Supplier: Mouser
D2 = Diode: Default Diode; Manufacturer: STMicroelectronics; ClassName: PowerSupplies; PartNumber: 1N5822; Price: 0.47; Supplier: Mouser
D4 = FM5819-W: Schottky Diodes & Rectifiers Vr/40V Io/2A T/R; pin to pad: 1>A 2>C; Manufacturer: Rectron; ClassName: PowerSupplies; PartNumber: FM205-W; Price: 0.15; Supplier: Mouser
D5 = MAX6107EUR+T: 4V5 Voltage References uPower Low-Dropout Voltage Ref; Manufacturer: Maxim Integrated; ClassName: PowerSupplies; PartNumber: MAX6107EUR; Price: 1.14; Supplier: Mouser
D6 = ADR510ARTZ-REEL7: Voltage References 1.0V Prec Shunt Low Noise; Manufacturer: Analog Devices; ClassName: PowerSupplies; PartNumber: ADR510ARTZ; Price: 1.48; Supplier: Mouser
L4 = Inductor: Chip Inductor; PartNumber: SDE0805A-331K; Manufacturer: Bourns; ClassName: PowerSupplies; Price: 0.57; Supplier: Mouser
R56 = Res: as R79 on sheet TemperatureACQ; ClassName: PowerSupplies; Price: 0.044; Supplier: Mouser
R58 = Res: Resistor; PartNumber: RES.1K.1/8W.5%.SMD.0805; Manufacturer: Yageo; ClassName: PowerSupplies; Price: 0.012; Supplier: Mouser
TZ7 = SLD30-018: as TZ9 on sheet SpeedACQ; ClassName: PowerSupplies; PartNumber: SLD24-018; Price: 3.17; Supplier: Mouser
U6 = TL2575-05IKTTR: Switching Voltage Regulators 1-A Step-Down Voltage; Manufacturer: Texas Instruments; ClassName: PowerSupplies; PartNumber: TL2575-05; Price: 2.28; Supplier: Mouser
U7 = LM78L10: 3-TERMINAL 0.1A POSITIVE VOLTAGE REGULATOR; Manufacturer: ON Semiconductor; Price: 0.48; ClassName: PowerSupplies; PartNumber: LM78L10; Supplier: Mouser
U8 = LM78L10: 3-TERMINAL 0.1A POSITIVE VOLTAGE REGULATOR; Price: 0.48; ClassName: PowerSupplies; PartNumber: LM78L10; Supplier: Mouser; Manufacturer: LM78L10

## Sheet MCU.SchDoc: MCU
size A4; Author: Joao Guimaraes; Organization: Altium Limited; Address1: L3, 12a Rodborough Rd; Address2: Frenchs Forest; Address3: NSW; Address4: Australia 2086; Revision: 1.0.0
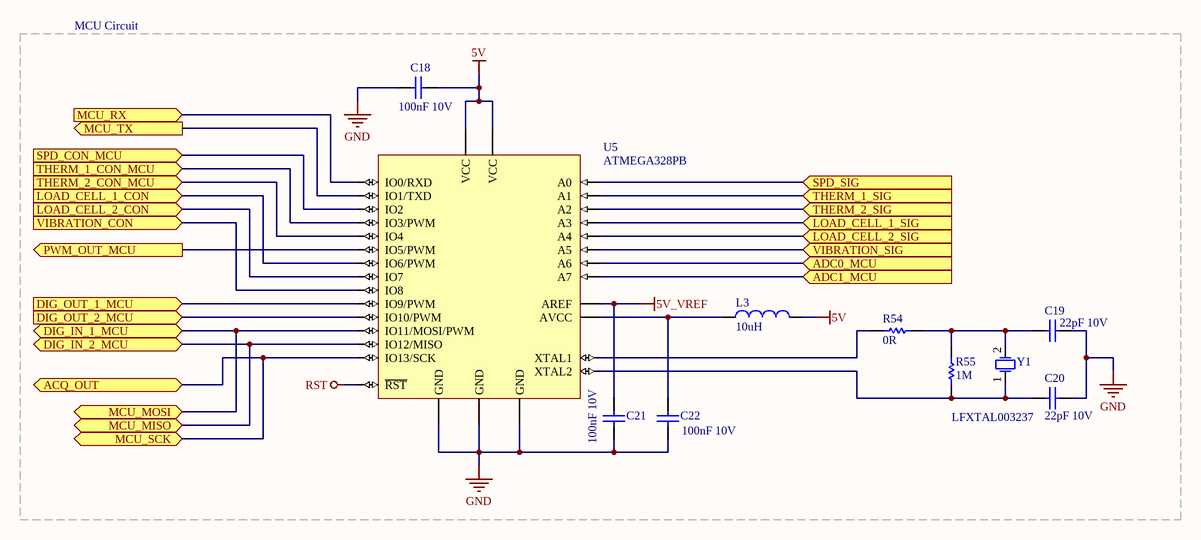
[diagram p6: MCU.SchDoc]

### Parts
C18  100nF 10V  [0402]
C19  22pF 10V  [1608[0603]]
C20  22pF 10V  [1608[0603]]
C21  100nF 10V  [0402]
C22  100nF 10V  [0402]
L3  10uH  [6-0805_M]
R54  0R  [6-0805_M]
R55  1M  [6-0805_M]
U5  ATMEGA328PB  [QFP80P900X900X120-32N]
Y1  LFXTAL003237  [HC49/4HSMX]

### Blocks framed on the sheet
MCU Circuit: C18-C22 L3 R54 R55 U5 Y1

### Ports
ACQ_OUT (bidir), ADC0_MCU (in), ADC1_MCU (in), DIG_IN_1_MCU, DIG_IN_2_MCU, DIG_OUT_1_MCU (in), DIG_OUT_2_MCU (in), LOAD_CELL_1_CON (in), LOAD_CELL_1_SIG (in), LOAD_CELL_2_CON (in), LOAD_CELL_2_SIG (in), MCU_MISO (bidir), MCU_MOSI (bidir), MCU_RX (in), MCU_SCK (bidir), MCU_TX (out), PWM_OUT_MCU (out), SPD_CON_MCU (in), SPD_SIG (in), THERM_1_CON_MCU (in), THERM_1_SIG (in), THERM_2_CON_MCU (in), THERM_2_SIG (in), VIBRATION_CON (in), VIBRATION_SIG (in)

### Nets
5V: C18.2 L3.2 U5.4(VCC) U5.6(VCC)
5V_VREF: C21.2 U5.20(AREF)
GND: C18.1 C19.2 C20.2 C21.1 C22.1 U5.3(GND) U5.5(GND) U5.21(GND)
RST: U5.29(~{RST})
NetC19_1: C19.1 R54.2 R55.1 Y1.2(OSC2)
NetC20_1: C20.1 R55.2 U5.8(XTAL2) Y1.1(OSC1)
NetC22_2: C22.2 L3.1 U5.18(AVCC)
NetC38_2: U5.23(A0) ; port SPD_SIG
NetP5_1: U5.16(IO12/MISO) ; port DIG_IN_2_MCU, port MCU_MISO
NetP5_3: U5.17(IO13/SCK) ; port ACQ_OUT, port MCU_SCK
NetP5_4: U5.15(IO11/MOSI/PWM) ; port DIG_IN_1_MCU, port MCU_MOSI
NetQ6_3: U5.32(IO2) ; port SPD_CON_MCU
NetQ7_3: U5.12(IO8) ; port VIBRATION_CON
NetR7_1: U5.13(IO9/PWM) ; port DIG_OUT_1_MCU
NetR13_1: U5.14(IO10/PWM) ; port DIG_OUT_2_MCU
NetR15_2: U5.19(A6) ; port ADC0_MCU
NetR17_1: U5.22(A7) ; port ADC1_MCU
NetR19_2: U5.10(IO6/PWM) ; port LOAD_CELL_1_CON
NetR20_2: U5.26(A3) ; port LOAD_CELL_1_SIG
NetR27_2: U5.11(IO7) ; port LOAD_CELL_2_CON
NetR28_2: U5.27(A4) ; port LOAD_CELL_2_SIG
NetR45_2: U5.2(IO4) ; port THERM_2_CON_MCU
NetR46_2: U5.1(IO3/PWM) ; port THERM_1_CON_MCU
NetR54_1: R54.1 U5.7(XTAL1)
NetR64_1: U5.9(IO5/PWM) ; port PWM_OUT_MCU
NetR79_1: U5.24(A1) ; port THERM_1_SIG
NetR88_1: U5.25(A2) ; port THERM_2_SIG
NetR96_2: U5.31(IO1/TXD) ; port MCU_TX
NetR97_2: U5.30(IO0/RXD) ; port MCU_RX
NetR99_1: U5.28(A5) ; port VIBRATION_SIG

### Notes on the sheet
- Title:
- Project:
- Date:
- Author:
- Version:
- File:

### Library data of the parts
C18 C21 C22 = Cap: as C40 on sheet TemperatureACQ; ClassName: MCU; Price: 0.015; Supplier: Mouser
C19 C20 = Cap: Capacitor; PartNumber: CAP.22p.10V.5%.SMD.0603; Manufacturer: Wurth; ClassName: MCU; Price: 0.10; Supplier: Mouser
L3 = Inductor: Chip Inductor; PartNumber: LBC2012T100M; Manufacturer: Taiyo Yuden; ClassName: MCU; Price: 0.20; Supplier: Mouser
R54 = Res: as R79 on sheet TemperatureACQ; ClassName: MCU; Price: 0.044; Supplier: Mouser
R55 = Res: as R86 on sheet TemperatureACQ; ClassName: MCU; Price: 0.012; Supplier: Mouser
U5 = ATMEGA328PB-AU: 8-bit AVR® RISC-based microcontroller (MCU) with picoPower® technology.; Manufacturer: Microchip; ClassName: MCU; PartNumber: ATMEGA328PB; Price: 1.65; Supplier: Mouser
Y1 = LFXTAL003237: Crystals 16.0MHz 13.4 x 4.9 x 4.3mm; Manufacturer: IQD; ClassName: MCU; PartNumber: LFXTAL003237; Price: 0.54; Supplier: Mouser

## Sheet PwmOut.SchDoc: PwmOut
size A4; Author: Joao Guimaraes; Organization: Altium Limited; Address1: L3, 12a Rodborough Rd; Address2: Frenchs Forest; Address3: NSW; Address4: Australia 2086; Revision: 1.0.0
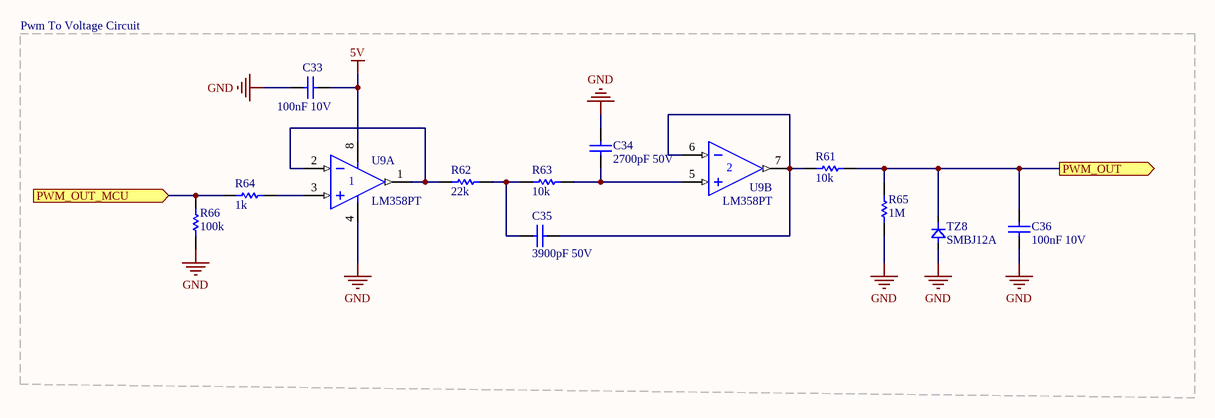
[diagram p7: PwmOut.SchDoc]

### Parts
C33  100nF 10V  [0402]
C34  2700pF 50V  [C0805]
C35  3900pF 50V  [C0805]
C36  100nF 10V  [C0805]
R61  10k  [6-0805_M]
R62  22k  [6-0805_M]
R63  10k  [6-0805_M]
R64  1k  [6-0805_M]
R65  1M  [6-0805_M]
R66  100k  [6-0805_M]
TZ8  SMBJ12A  [DO-214AA]
U9  LM358PT  [TSOP-8]  (parts A,B of 2)

### Blocks framed on the sheet
Pwm To Voltage Circuit: C33-C36 R61-R66 TZ8 U9

### Ports
PWM_OUT (out), PWM_OUT_MCU (in)

### Nets
5V: C33.2 U9.8(Vs+)
GND: C33.1 C34.2 C36.2 R65.1 R66.1 TZ8.1(A) U9.4(Vs-)
NetC34_1: C34.1 R63.2 U9.5(IN+)
NetC35_1: C35.1 R62.2 R63.1
NetC35_2: C35.2 R61.1 U9.6(IN-) U9.7(OUT)
NetC36_1: C36.1 R61.2 R65.2 TZ8.2(C) ; port PWM_OUT
NetR62_1: R62.1 U9.1(OUT) U9.2(IN-)
NetR64_1: R64.1 R66.2 ; port PWM_OUT_MCU
NetR64_2: R64.2 U9.3(IN+)

### Notes on the sheet
- Title:
- Project:
- Date:
- Author:
- Version:
- File:

### Library data of the parts
C33 = Cap: as C40 on sheet TemperatureACQ; ClassName: PwmOut; Price: 0.015; Supplier: Mouser
C34 = Cap: Capacitor; PartNumber: CAP.2700p.50V.10%.SMD.0805; Manufacturer: Vishay; ClassName: PwmOut; Price: 0.10; Supplier: Mouser
C35 = Cap: Capacitor; PartNumber: CAP.3900p.50V.5%.SMD.0805; Manufacturer: Vishay; ClassName: PwmOut; Price: 0.10; Supplier: Mouser
C36 = Cap: as C49 on sheet TemperatureACQ; ClassName: PowerSupplies; Price: 0.17; Supplier: Mouser
R61 R63 = Res: as R78 on sheet TemperatureACQ; ClassName: PwmOut; Price: 0.012; Supplier: Mouser
R62 = Res: Resistor; PartNumber: RES.22K.1/8W.5%.SMD.0805; Manufacturer: Bourns; ClassName: PwmOut; Price: 0.10; Supplier: Mouser
R64 = Res: as R58 on sheet PowerSupplies; ClassName: PwmOut; Price: 0.012; Supplier: Mouser
R65 = Res: as R86 on sheet TemperatureACQ; ClassName: PwmOut; Price: 0.012; Supplier: Mouser
R66 = Res: as R101 on sheet VibrationACQ; ClassName: PwmOut; Price: 0.012; Supplier: Mouser
TZ8 = SMBJ12A: ESD Suppressors / TVS Diodes 12V 600W SMB Unidirectional; pin to pad: 1>A 2>C; Manufacturer: ON Semiconductor; ClassName: PwmOut; PartNumber: SMBJ12A; Price: 0.37; Supplier: Mouser
U9 = LM358PT: as U12 on sheet TemperatureACQ; ClassName: PwmOut; PartNumber: LM358PT; Price: 0.40; Supplier: Mouser

## Sheet DigitalInterfaces.SchDoc: DigitalInterfaces
size A4; Author: Joao Guimaraes; Organization: Altium Limited; Address1: L3, 12a Rodborough Rd; Address2: Frenchs Forest; Address3: NSW; Address4: Australia 2086; Revision: 1.0.0
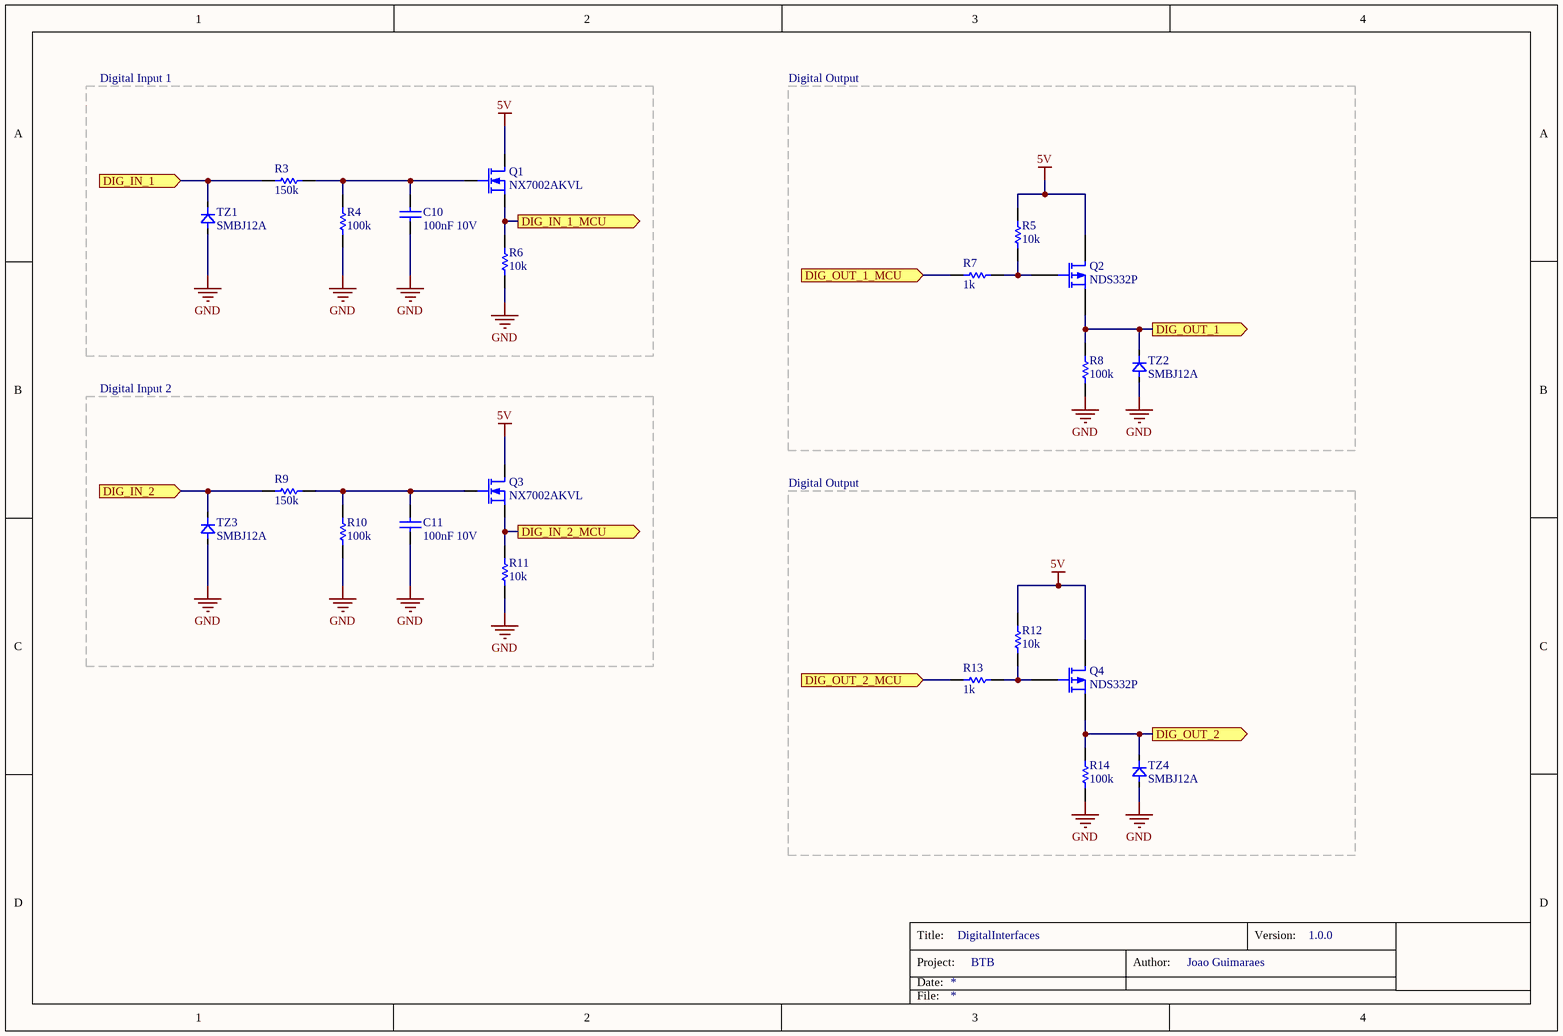
[diagram p8: DigitalInterfaces.SchDoc]

### Parts
C10  100nF 10V  [0402]
C11  100nF 10V  [0402]
Q1  NX7002AKVL  [SOT23_M]
Q2  NDS332P  [SOT23_M]
Q3  NX7002AKVL  [SOT23_M]
Q4  NDS332P  [SOT23_M]
R3  150k  [6-0805_M]
R4  100k  [6-0805_M]
R5  10k  [6-0805_M]
R6  10k  [6-0805_M]
R7  1k  [6-0805_M]
R8  100k  [6-0805_M]
R9  150k  [6-0805_M]
R10  100k  [6-0805_M]
R11  10k  [6-0805_M]
R12  10k  [6-0805_M]
R13  1k  [6-0805_M]
R14  100k  [6-0805_M]
TZ1  SMBJ12A  [DO-214AA]
TZ2  SMBJ12A  [DO-214AA]
TZ3  SMBJ12A  [DO-214AA]
TZ4  SMBJ12A  [DO-214AA]

### Blocks framed on the sheet
Digital Input 1: C10 Q1 R3 R4 R6 TZ1
Digital Output: Q2 R5 R7 R8 TZ2
Digital Input 2: C11 Q3 R9-R11 TZ3
Digital Output: Q4 R12-R14 TZ4

### Ports
DIG_IN_1 (in), DIG_IN_1_MCU (out), DIG_IN_2 (in), DIG_IN_2_MCU (out), DIG_OUT_1 (out), DIG_OUT_1_MCU (in), DIG_OUT_2 (out), DIG_OUT_2_MCU (in)

### Nets
5V: Q1.3(D) Q2.1(D) Q3.3(D) Q4.1(D) R5.2 R12.2
GND: C10.1 C11.1 R4.1 R6.1 R8.1 R10.1 R11.1 R14.1 TZ1.1(A) TZ2.1(A) TZ3.1(A) TZ4.1(A)
NetC10_2: C10.2 Q1.1(G) R3.2 R4.2
NetC11_2: C11.2 Q3.1(G) R9.2 R10.2
NetP4_5: Q2.2(S) R8.2 TZ2.2(C) ; port DIG_OUT_1
NetP4_7: Q4.2(S) R14.2 TZ4.2(C) ; port DIG_OUT_2
NetP4_9: R3.1 TZ1.2(C) ; port DIG_IN_1
NetP4_11: R9.1 TZ3.2(C) ; port DIG_IN_2
NetP5_1: Q3.2(S) R11.2 ; port DIG_IN_2_MCU
NetP5_4: Q1.2(S) R6.2 ; port DIG_IN_1_MCU
NetQ2_3: Q2.3(G) R5.1 R7.2
NetQ4_3: Q4.3(G) R12.1 R13.2
NetR7_1: R7.1 ; port DIG_OUT_1_MCU
NetR13_1: R13.1 ; port DIG_OUT_2_MCU

### Notes on the sheet
- Title:
- Project:
- Date:
- Author:
- Version:
- File:

### Library data of the parts
C10 C11 = Cap: as C40 on sheet TemperatureACQ; ClassName: DigitalInterfaces; Price: 0.015; Supplier: Mouser
Q1 Q3 = NX7002AKVL: as Q7 on sheet VibrationACQ; ClassName: DigitalInterfaces; PartNumber: NX7002AKVL; Price: 0.16; Supplier: Mouser
Q2 = NDS332P: P-Channel Logic Level Enhancement MOSFET; ClassName: DigitalInterfaces; Price: 0.40; PartNumber: NDS332P; Supplier: Mouser; Manufacturer: NDS332P
Q4 = NDS332P: P-Channel Logic Level Enhancement MOSFET; Manufacturer: ON Semiconductor; ClassName: DigitalInterfaces; Price: 0.40; PartNumber: NDS332P; Supplier: Mouser
R3 R9 = Res: as R75 on sheet SpeedACQ; ClassName: DigitalInterfaces; Price: 0.10; Supplier: Mouser
R4 R8 R10 R12 R14 = Res: Resistor; PartNumber: RES.100K.1/8W.5%.SMD.0805; Manufacturer: Vishay; ClassName: DigitalInterfaces; Price: 0.012; Supplier: Mouser
R5 R6 R11 = Res: as R78 on sheet TemperatureACQ; ClassName: DigitalInterfaces; Supplier: Mouser
  R5: Price: 0.013
  R6 R11: Price: 0.012
R7 R13 = Res: as R58 on sheet PowerSupplies; ClassName: DigitalInterfaces; Price: 0.012; Supplier: Mouser
TZ1-TZ4 = SMBJ12A: ESD Suppressors / TVS Diodes 12V 600W SMB Unidirectional; pin to pad: 1>A 2>C; Manufacturer: ON Semiconductor; ClassName: DigitalInterfaces; PartNumber: SMBJ12A; Price: 0.37; Supplier: Mouser

## Sheet Connectors.SchDoc: Connectors
size A4; Author: Joao Guimaraes; Organization: Altium Limited; Address1: L3, 12a Rodborough Rd; Address2: Frenchs Forest; Address3: NSW; Address4: Australia 2086; Revision: 1.0.0
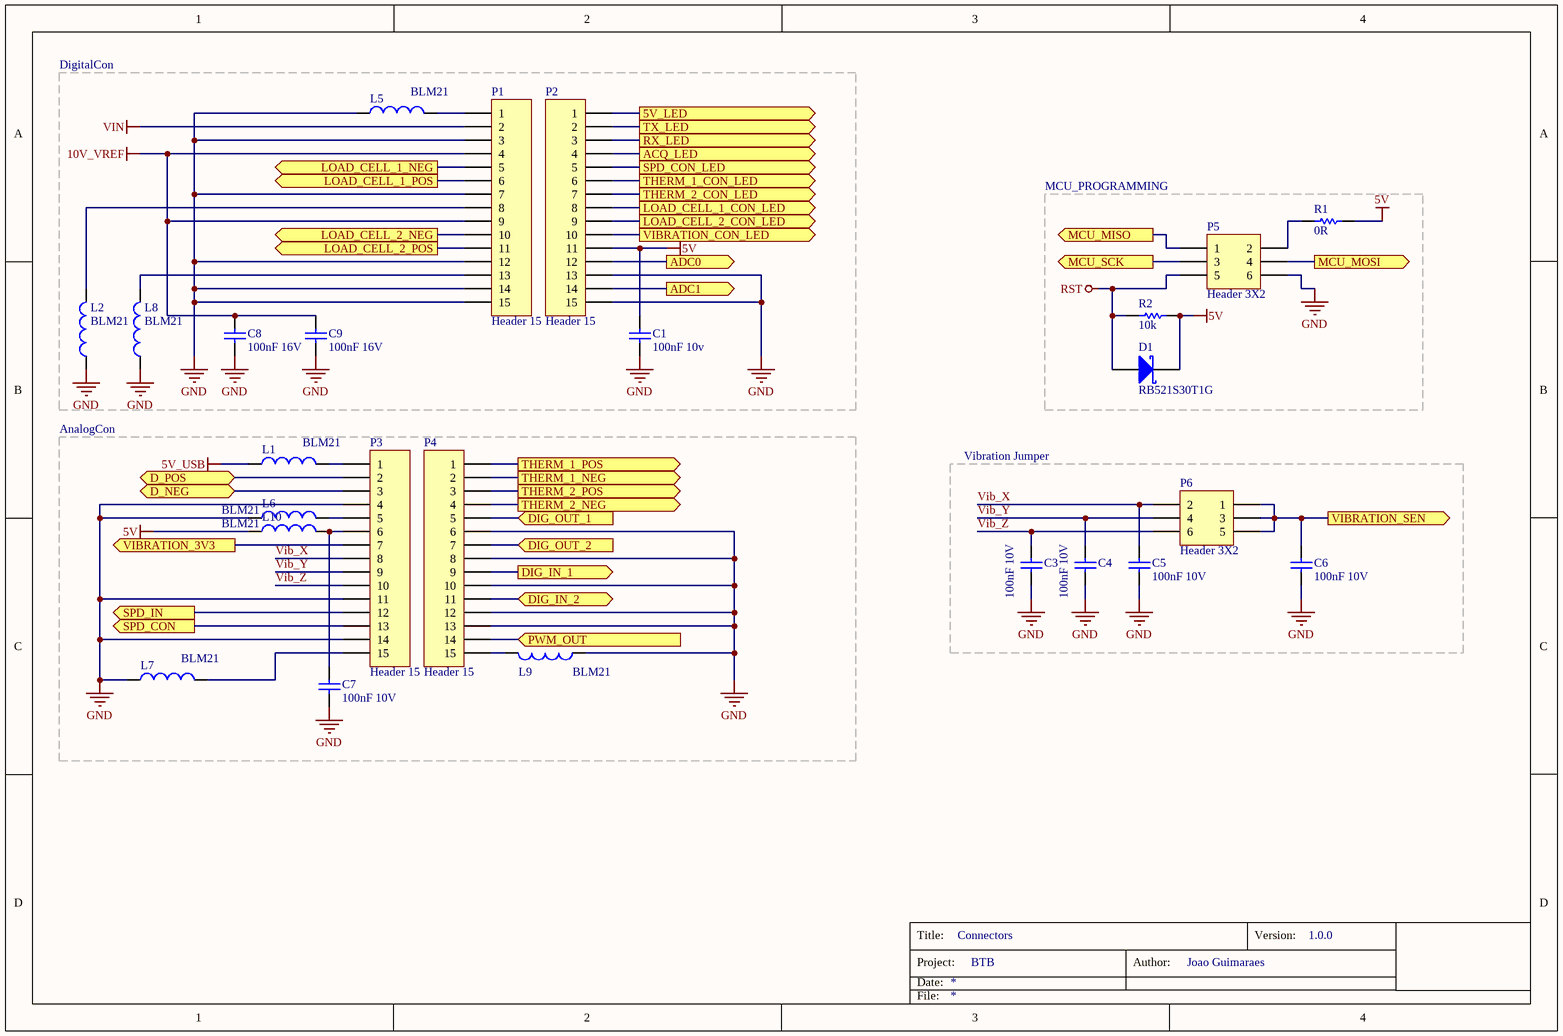
[diagram p9: Connectors.SchDoc]

### Parts
C1  100nF 10v  [C0805]
C3  100nF 10V  [C0805]
C4  100nF 10V  [C0805]
C5  100nF 10V  [C0805]
C6  100nF 10V  [C0805]
C7  100nF 10V  [C0805]
C8  100nF 16V  [C0805]
C9  100nF 16V  [C0805]
D1  RB521S30T1G  [SOD-523]
L1  BLM21  [6-0805_M]
L2  BLM21  [6-0805_M]
L5  BLM21  [6-0805_M]
L6  BLM21  [6-0805_M]
L7  BLM21  [6-0805_M]
L8  BLM21  [6-0805_M]
L9  BLM21  [6-0805_M]
L10  BLM21  [6-0805_M]
P1  Header 15  [HDR1X15]
P2  Header 15  [HDR1X15]
P3  Header 15  [HDR1X15]
P4  Header 15  [HDR1X15]
P5  Header 3X2  [HDR2X3]
P6  Header 3X2  [HDR2X3]
R1  0R  [6-0805_M]
R2  10k  [6-0805_M]

### Blocks framed on the sheet
DigitalCon: C1 C8 C9 L2 L5 L8 P1 P2
MCU_PROGRAMMING: D1 P5 R1 R2
AnalogCon: C7 L1 L6 L7 L9 L10 P3 P4
Vibration Jumper: C3-C6 P6

### Ports
5V_LED (out), ACQ_LED (out), ADC0 (out), ADC1 (out), D_NEG, D_POS, DIG_IN_1 (out), DIG_IN_2, DIG_OUT_1 (in), DIG_OUT_2 (in), LOAD_CELL_1_CON_LED (out), LOAD_CELL_1_NEG (out), LOAD_CELL_1_POS (out), LOAD_CELL_2_CON_LED (out), LOAD_CELL_2_NEG (out), LOAD_CELL_2_POS (out), MCU_MISO (out), MCU_MOSI (out), MCU_SCK (out), PWM_OUT (in), RX_LED (out), SPD_CON (out), SPD_CON_LED (out), SPD_IN (out), THERM_1_CON_LED (out), THERM_1_NEG (out), THERM_1_POS (out), THERM_2_CON_LED (out), THERM_2_NEG (out), THERM_2_POS (out), TX_LED (out), VIBRATION_3V3 (out), VIBRATION_CON_LED (out), VIBRATION_SEN (out)

### Nets
5V: C1.2 D1.2(K) L10.1 P2.11 R1.2 R2.2
5V_USB: L1.1
10V_VREF: C8.2 C9.2 P1.4 P1.9
GND: C1.1 C3.1 C4.1 C5.1 C6.1 C7.1 C8.1 C9.1 L2.1 L5.1 L6.1 L7.1 L8.1 L9.1 P1.3 P1.7 P1.12 P1.14 P1.15 P2.13 P2.15 P3.4 P3.11 P3.14 P4.6 P4.8 P4.10 P4.12 P4.13 P5.6
RST: D1.1(A) P5.5 R2.1
VIN: P1.2
Vib_X: C5.2 P3.8 P6.2
Vib_Y: C4.2 P3.9 P6.4
Vib_Z: C3.2 P3.10 P6.6
NetC6_2: C6.2 P6.1 P6.3 P6.5 ; port VIBRATION_SEN
NetC7_2: C7.2 L10.2 P3.6
NetC36_1: P4.14 ; port PWM_OUT
NetL1_2: L1.2 P3.1
NetL2_2: L2.2 P1.8
NetL5_2: L5.2 P1.1
NetL6_2: L6.2 P3.5
NetL7_2: L7.2 P3.15
NetL8_2: L8.2 P1.13
NetL9_2: L9.2 P4.15
NetP1_5: P1.5 ; port LOAD_CELL_1_NEG
NetP1_6: P1.6 ; port LOAD_CELL_1_POS
NetP1_10: P1.10 ; port LOAD_CELL_2_NEG
NetP1_11: P1.11 ; port LOAD_CELL_2_POS
NetP2_1: P2.1 ; port 5V_LED
NetP2_2: P2.2 ; port TX_LED
NetP2_3: P2.3 ; port RX_LED
NetP2_4: P2.4 ; port ACQ_LED
NetP2_5: P2.5 ; port SPD_CON_LED
NetP2_6: P2.6 ; port THERM_1_CON_LED
NetP2_7: P2.7 ; port THERM_2_CON_LED
NetP2_8: P2.8 ; port LOAD_CELL_1_CON_LED
NetP2_9: P2.9 ; port LOAD_CELL_2_CON_LED
NetP2_10: P2.10 ; port VIBRATION_CON_LED
NetP2_12: P2.12 ; port ADC0
NetP2_14: P2.14 ; port ADC1
NetP3_2: P3.2 ; port D_POS
NetP3_3: P3.3 ; port D_NEG
NetP3_7: P3.7 ; port VIBRATION_3V3
NetP3_12: P3.12 ; port SPD_IN
NetP3_13: P3.13 ; port SPD_CON
NetP4_1: P4.1 ; port THERM_1_POS
NetP4_2: P4.2 ; port THERM_1_NEG
NetP4_3: P4.3 ; port THERM_2_POS
NetP4_4: P4.4 ; port THERM_2_NEG
NetP4_5: P4.5 ; port DIG_OUT_1
NetP4_7: P4.7 ; port DIG_OUT_2
NetP4_9: P4.9 ; port DIG_IN_1
NetP4_11: P4.11 ; port DIG_IN_2
NetP5_1: P5.1 ; port MCU_MISO
NetP5_2: P5.2 R1.1
NetP5_3: P5.3 ; port MCU_SCK
NetP5_4: P5.4 ; port MCU_MOSI

### Notes on the sheet
- Title:
- Project:
- Date:
- Author:
- Version:
- File:

### Library data of the parts
C1 C3-C9 = Cap: as C40 on sheet TemperatureACQ; ClassName: MCU; Price: 0.015; Supplier: Mouser
D1 = RB521S30T1G: Schottky Diodes & Rectifiers 30V 200mW Single; pin to pad: 1>2 2>1; Manufacturer: ON Semiconductor; ClassName: Connectors; PartNumber: RB521S30T1G; Price: 0.18; Supplier: Mouser
L1 L2 L5-L10 = Inductor: Chip Inductor; Manufacturer: Murata Electronics; ClassName: Connectors; PartNumber: BLM21; Price: 0.19; Supplier: Mouser
P1-P4 = Header 15: Header, 15-Pin
P5 P6 = Header 3X2: Header, 3-Pin, Dual row; ClassName: Connectors; PartNumber: Header 3X2; Price: 1.00; Supplier: ContatoPro
R1 = Res: as R79 on sheet TemperatureACQ; ClassName: TemperatureACQ; Price: 0.044; Supplier: Mouser
R2 = Res: as R78 on sheet TemperatureACQ; ClassName: Connectors; Price: 0.012; Supplier: Mouser

## Sheet Leds.SchDoc: Leds
size A4; Author: Joao Guimaraes; Organization: Altium Limited; Address1: L3, 12a Rodborough Rd; Address2: Frenchs Forest; Address3: NSW; Address4: Australia 2086; Revision: 1.0.0
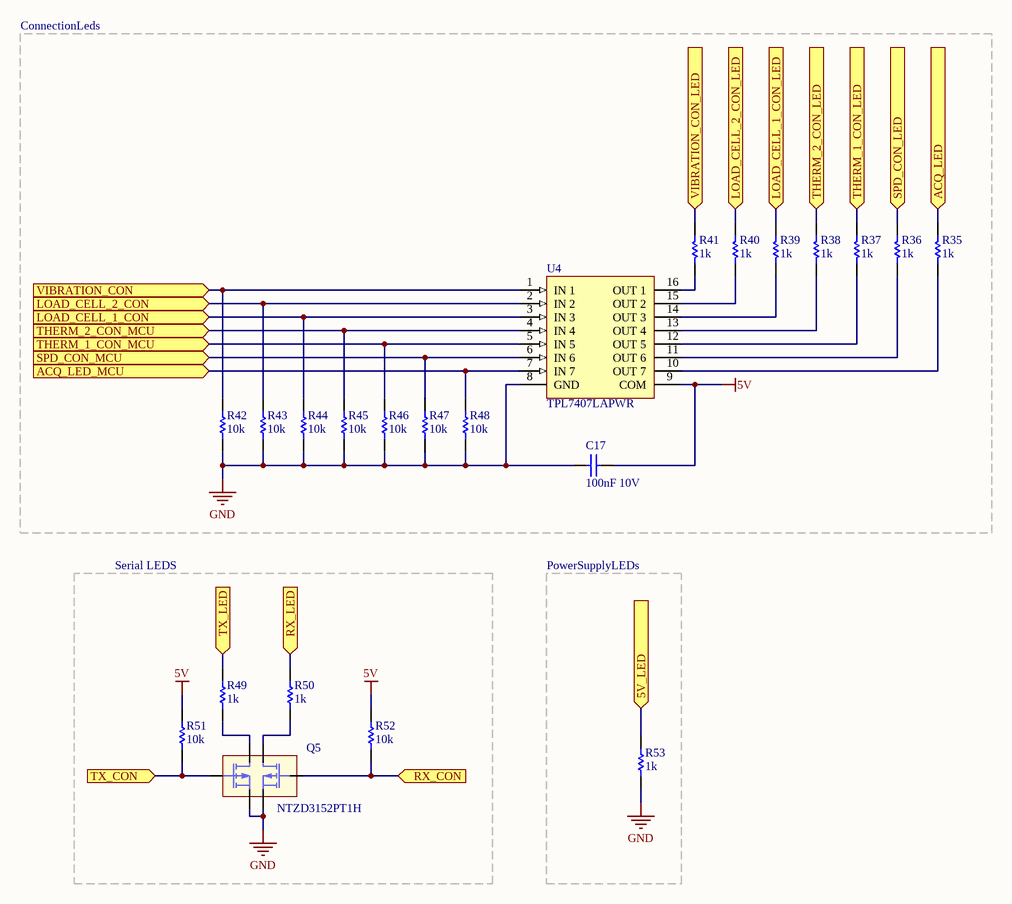
[diagram p10: Leds.SchDoc]

### Parts
C17  100nF 10V  [0402]
Q5  NTZD3152PT1H  [SOT23-6_M]
R35  1k  [6-0805_M]
R36  1k  [6-0805_M]
R37  1k  [6-0805_M]
R38  1k  [6-0805_M]
R39  1k  [6-0805_M]
R40  1k  [6-0805_M]
R41  1k  [6-0805_M]
R42  10k  [6-0805_M]
R43  10k  [6-0805_M]
R44  10k  [6-0805_M]
R45  10k  [6-0805_M]
R46  10k  [6-0805_M]
R47  10k  [6-0805_M]
R48  10k  [6-0805_M]
R49  1k  [6-0805_M]
R50  1k  [6-0805_M]
R51  10k  [6-0805_M]
R52  10k  [6-0805_M]
R53  1k  [6-0805_M]
U4  TPL7407LAPWR  [TSOP-16]

### Blocks framed on the sheet
ConnectionLeds: C17 R35-R48 U4
Serial LEDS: Q5 R49-R52
PowerSupplyLEDs: R53

### Ports
5V_LED (in), ACQ_LED (in), ACQ_LED_MCU (in), LOAD_CELL_1_CON (in), LOAD_CELL_1_CON_LED (in), LOAD_CELL_2_CON (in), LOAD_CELL_2_CON_LED (in), RX_CON (in), RX_LED (in), SPD_CON_LED (in), SPD_CON_MCU (in), THERM_1_CON_LED (in), THERM_1_CON_MCU (in), THERM_2_CON_LED (in), THERM_2_CON_MCU (in), TX_CON (in), TX_LED (in), VIBRATION_CON (in), VIBRATION_CON_LED (in)

### Nets
5V: C17.2 R51.2 R52.2 U4.9(COM)
GND: C17.1 Q5.1(S1) Q5.4(S2) R42.1 R43.1 R44.1 R45.1 R46.1 R47.1 R48.1 R53.1 U4.8(GND)
NetP2_1: R53.2 ; port 5V_LED
NetP2_2: R49.2 ; port TX_LED
NetP2_3: R50.2 ; port RX_LED
NetP2_4: R35.2 ; port ACQ_LED
NetP2_5: R36.2 ; port SPD_CON_LED
NetP2_6: R37.2 ; port THERM_1_CON_LED
NetP2_7: R38.2 ; port THERM_2_CON_LED
NetP2_8: R39.2 ; port LOAD_CELL_1_CON_LED
NetP2_9: R40.2 ; port LOAD_CELL_2_CON_LED
NetP2_10: R41.2 ; port VIBRATION_CON_LED
NetP5_3: R48.2 U4.7(IN_7) ; port ACQ_LED_MCU
NetQ5_2: Q5.2(G1) R51.1 ; port TX_CON
NetQ5_3: Q5.3(D2) R50.1
NetQ5_5: Q5.5(G2) R52.1 ; port RX_CON
NetQ5_6: Q5.6(D1) R49.1
NetQ6_3: R47.2 U4.6(IN_6) ; port SPD_CON_MCU
NetQ7_3: R42.2 U4.1(IN_1) ; port VIBRATION_CON
NetR19_2: R44.2 U4.3(IN_3) ; port LOAD_CELL_1_CON
NetR27_2: R43.2 U4.2(IN_2) ; port LOAD_CELL_2_CON
NetR35_1: R35.1 U4.10(OUT_7)
NetR36_1: R36.1 U4.11(OUT_6)
NetR37_1: R37.1 U4.12(OUT_5)
NetR38_1: R38.1 U4.13(OUT_4)
NetR39_1: R39.1 U4.14(OUT_3)
NetR40_1: R40.1 U4.15(OUT_2)
NetR41_1: R41.1 U4.16(OUT_1)
NetR45_2: R45.2 U4.4(IN_4) ; port THERM_2_CON_MCU
NetR46_2: R46.2 U4.5(IN_5) ; port THERM_1_CON_MCU

### Notes on the sheet
- Title:
- Project:
- Date:
- Author:
- Version:
- File:

### Library data of the parts
C17 = Cap: as C40 on sheet TemperatureACQ; ClassName: Leds; Price: 0.015; Supplier: Mouser
Q5 = NTZD3152PT1H: −20 V, −430 mA, Dual P−Channel with ESD Protection, SOT−563; PartNumber: NTZD315PT1H; Manufacturer: ON Semiconductor; ClassName: Leds; Price: 0.35; Supplier: Mouser
R35-R41 R49 R50 R53 = Res: as R58 on sheet PowerSupplies; ClassName: Leds; Price: 0.012; Supplier: Mouser
R42-R48 R51 R52 = Res: as R78 on sheet TemperatureACQ; ClassName: Leds; Price: 0.012; Supplier: Mouser
U4 = TPL7407LAPWR: Manufacturer: TL2575-05; ClassName: Leds; PartNumber: TPL7407LAPWR; Price: 0.64; Supplier: Mouser

## Sheet USB.SchDoc: USB
size A4; Author: Joao Guimaraes; Organization: Altium Limited; Address1: L3, 12a Rodborough Rd; Address2: Frenchs Forest; Address3: NSW; Address4: Australia 2086; Revision: 1.0.0
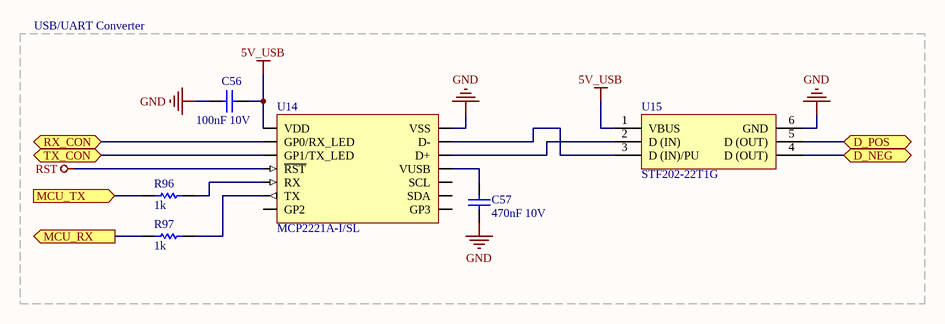
[diagram p11: USB.SchDoc]

### Parts
C56  100nF 10V  [0402]
C57  470nF 10V  [1608[0603]]
R96  1k  [6-0805_M]
R97  1k  [6-0805_M]
U14  MCP2221A-I/SL  [SOIC14_N]
U15  STF202-22T1G  [SOP6]

### Blocks framed on the sheet
USB/UART Converter: C56 C57 R96 R97 U14 U15

### Ports
D_NEG (bidir), D_POS (bidir), MCU_RX (out), MCU_TX (in), RX_CON, TX_CON

### Nets
5V_USB: C56.2 U14.1(VDD) U15.1(VBUS)
GND: C56.1 C57.1 U14.14(VSS) U15.6(GND)
RST: U14.4(~{RST})
NetC57_2: C57.2 U14.11(VUSB)
NetP3_2: U15.5(D_(OUT)) ; port D_POS
NetP3_3: U15.4(D_(OUT)) ; port D_NEG
NetQ5_2: U14.3(GP1/TX_LED) ; port TX_CON
NetQ5_5: U14.2(GP0/RX_LED) ; port RX_CON
NetR96_1: R96.1 U14.5(RX)
NetR96_2: R96.2 ; port MCU_TX
NetR97_1: R97.1 U14.6(TX)
NetR97_2: R97.2 ; port MCU_RX
NetU14_12: U14.12(D-) U15.3(D_(IN)/PU)
NetU14_13: U14.13(D+) U15.2(D_(IN))

Not connected (* = marked no-connect by the designer): U14 7(GP2) 8(GP3) 9(SDA) 10(SCL)

### Notes on the sheet
- Title:
- Project:
- Date:
- Author:
- Version:
- File:

### Library data of the parts
C56 = Cap: as C40 on sheet TemperatureACQ; ClassName: USB; Price: 0.015; Supplier: Mouser
C57 = Cap: Capacitor; PartNumber: CAP.470n.10V.20%.SMD.0603; Manufacturer: Vishay; ClassName: USB; Price: 0.15; Supplier: Mouser
R96 R97 = Res: as R58 on sheet PowerSupplies; ClassName: USB; Price: 0.012; Supplier: Mouser
U14 = MCP2221A-I/SL: USB Interface IC USB 2.0 to I2C Converter with GPIO; Manufacturer: Microchip; ClassName: USB; PartNumber: MCP2221A-I/SL; Price: 2.27; Supplier: Mouser
U15 = STF202-22T1G: Manufacturer: ON Semiconductor; ClassName: USB; PartNumber: STF202-22T1G; Price: 0.54; Supplier: Mouser

## Sheet ExtraADC.SchDoc: ExtraADC
size A4; Author: Joao Guimaraes; Organization: Altium Limited; Address1: L3, 12a Rodborough Rd; Address2: Frenchs Forest; Address3: NSW; Address4: Australia 2086; Revision: 1.0.0
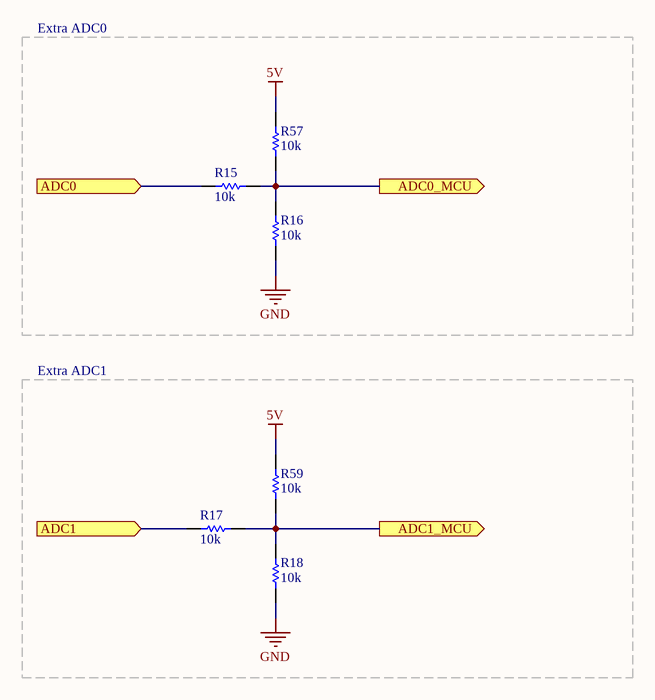
[diagram p12: ExtraADC.SchDoc]

### Parts
R15  10k  [6-0805_M]
R16  10k  [6-0805_M]
R17  10k  [6-0805_M]
R18  10k  [6-0805_M]
R57  10k  [6-0805_M]
R59  10k  [6-0805_M]

### Blocks framed on the sheet
Extra ADC0: R15 R16 R57
Extra ADC1: R17 R18 R59

### Ports
ADC0 (in), ADC0_MCU (out), ADC1 (in), ADC1_MCU (out)

### Nets
5V: R57.2 R59.2
GND: R16.1 R18.1
NetP2_12: R15.1 ; port ADC0
NetP2_14: R17.2 ; port ADC1
NetR15_2: R15.2 R16.2 R57.1 ; port ADC0_MCU
NetR17_1: R17.1 R18.2 R59.1 ; port ADC1_MCU

### Notes on the sheet
- Title:
- Project:
- Date:
- Author:
- Version:
- File:

### Library data of the parts
R15-R18 R57 R59 = Res: Resistor; PartNumber: RES.10k.1/8W.5%.SMD.0805; Manufacturer: Yageo; ClassName: PowerSupplies; Price: 0.013; Supplier: Mouser

## Sheet ProductComponents.SchDoc: ProductComponents
size A4; Author: Joao Guimaraes; Organization: Altium Limited; Address1: L3, 12a Rodborough Rd; Address2: Frenchs Forest; Address3: NSW; Address4: Australia 2086; Revision: 1.0.0; SheetNumber: 1
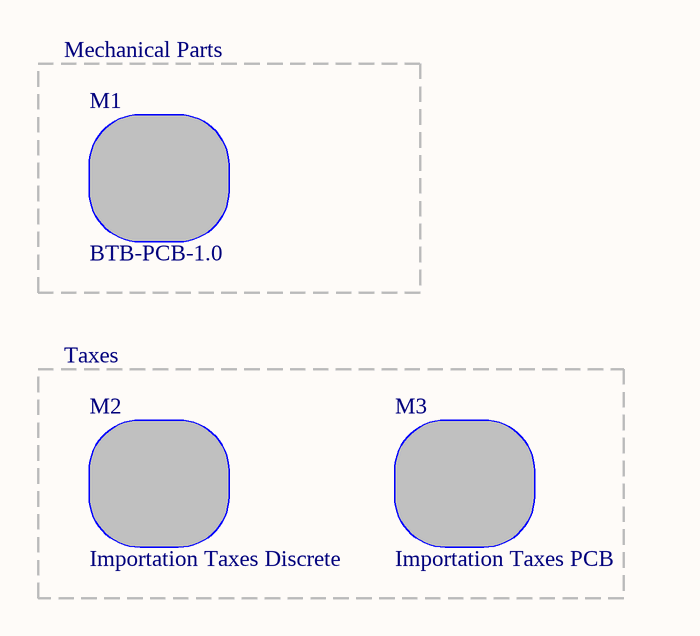
[diagram p13: ProductComponents.SchDoc]

### Parts
M1  BTB-PCB-1.0
M2  Importation Taxes Discrete
M3  Importation Taxes PCB

### Blocks framed on the sheet
Mechanical Parts: M1
Taxes: M2 M3

### Notes on the sheet
- Title:
- Project:
- Date:
- Author:
- Version:
- File:

### Library data of the parts
M1 = ProductComponent: Manufacturer: allpcb.com; ClassName: ProductComponents; Supplier: allpcb.com; Price: 34.37; PartNumber: BTB-PCB-1.0
M2 M3 = ProductComponent: ClassName: ProductComponents
  M2: Price: 40.67; PartNumber: Importation Taxes Discrete
  M3: Price: 44.10; PartNumber: Importation Taxes PCB